# EAGLE design HW-DC26-Badge-20180426-1.1 (EAGLE 8.4.1)
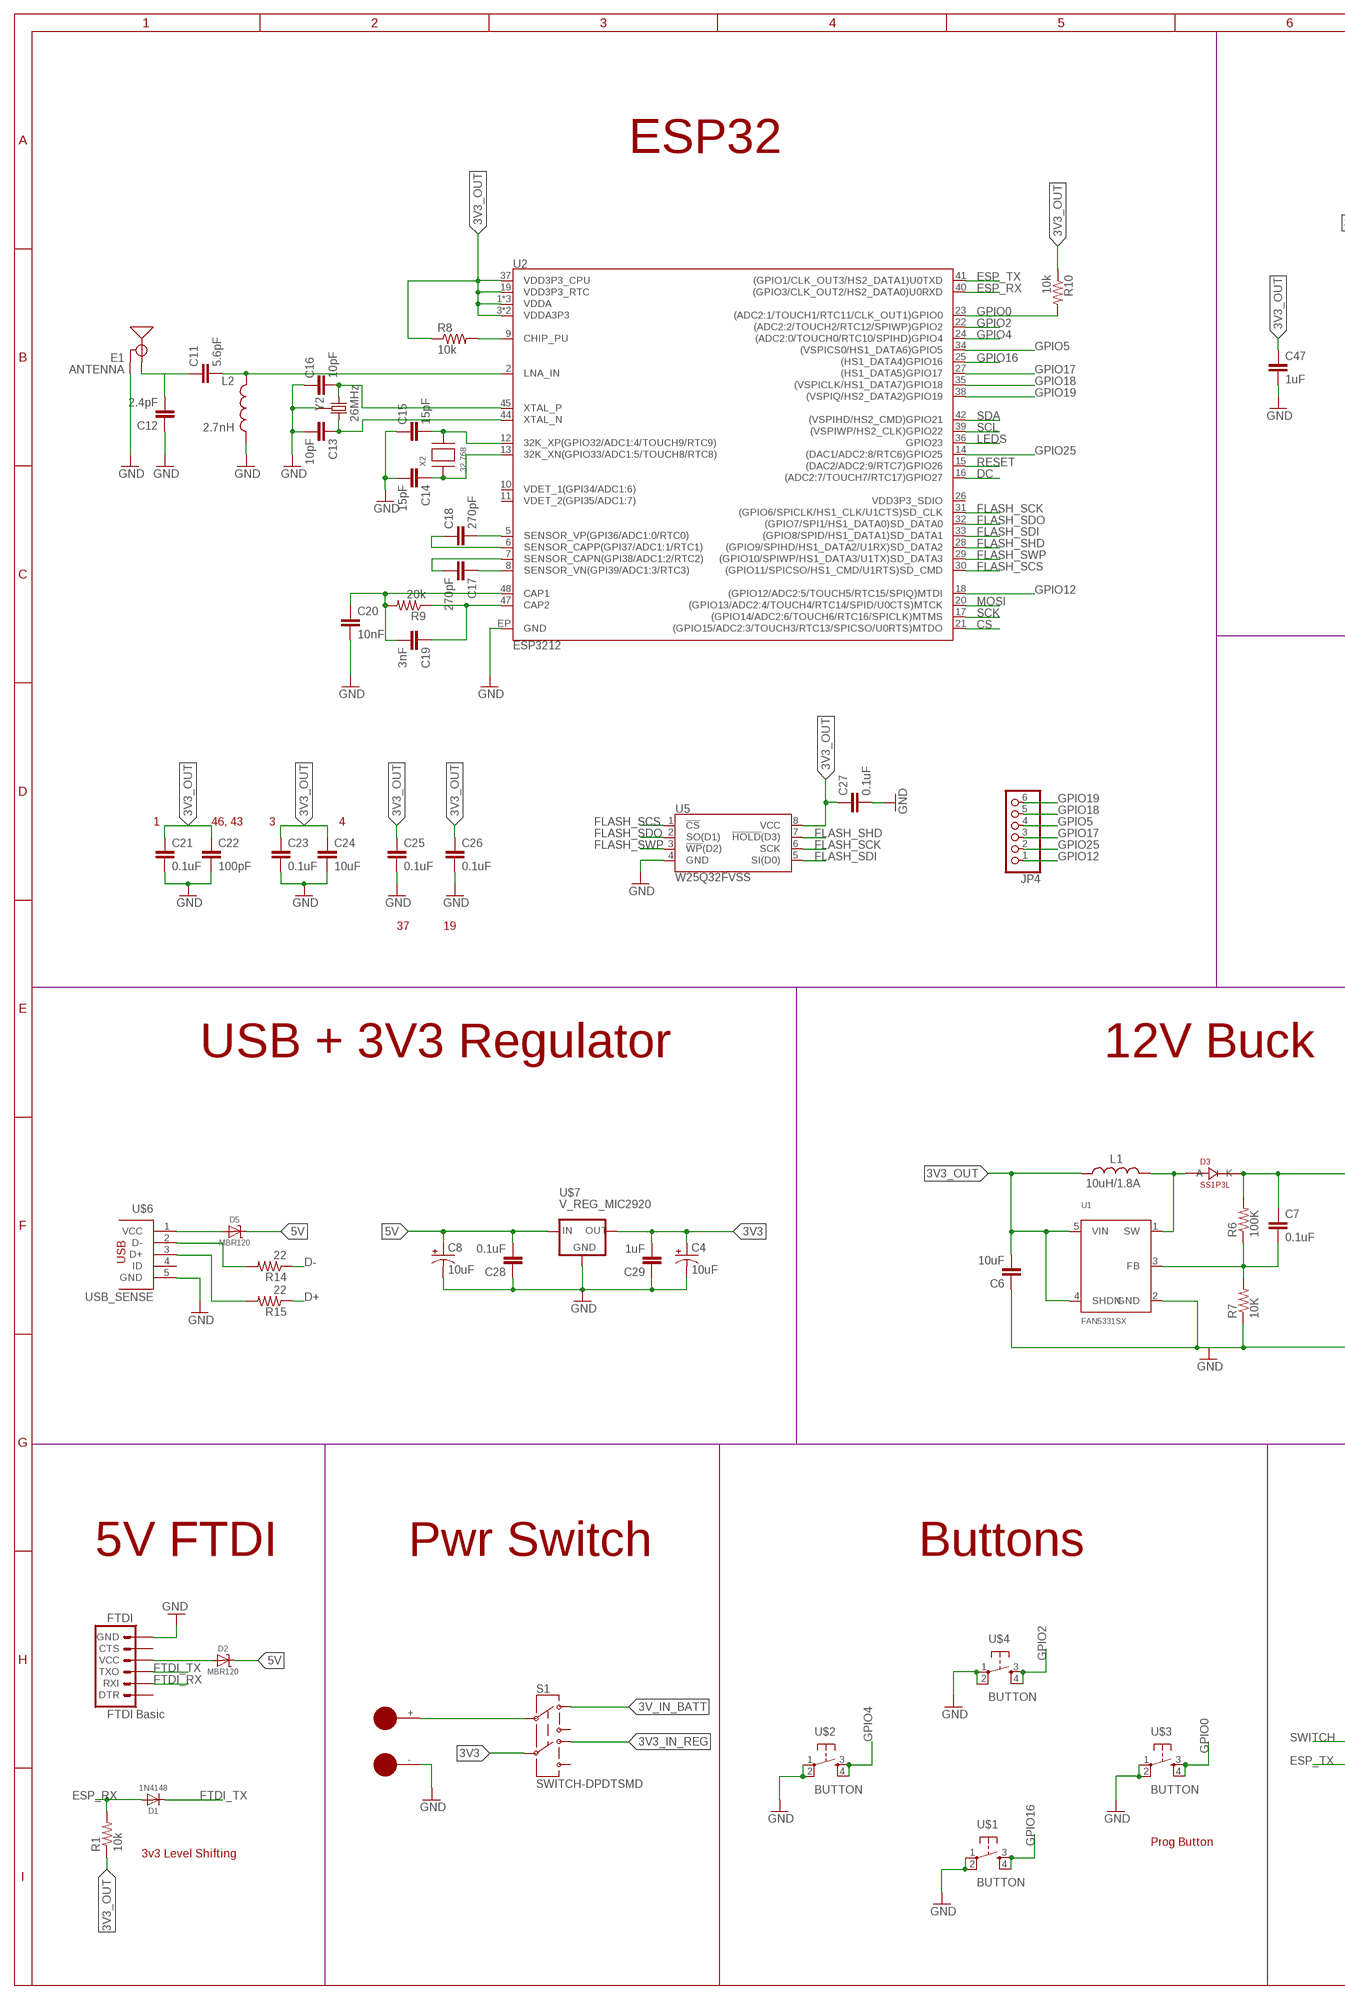
[diagram p0: schematic, sheet 1, part 1 of 2]
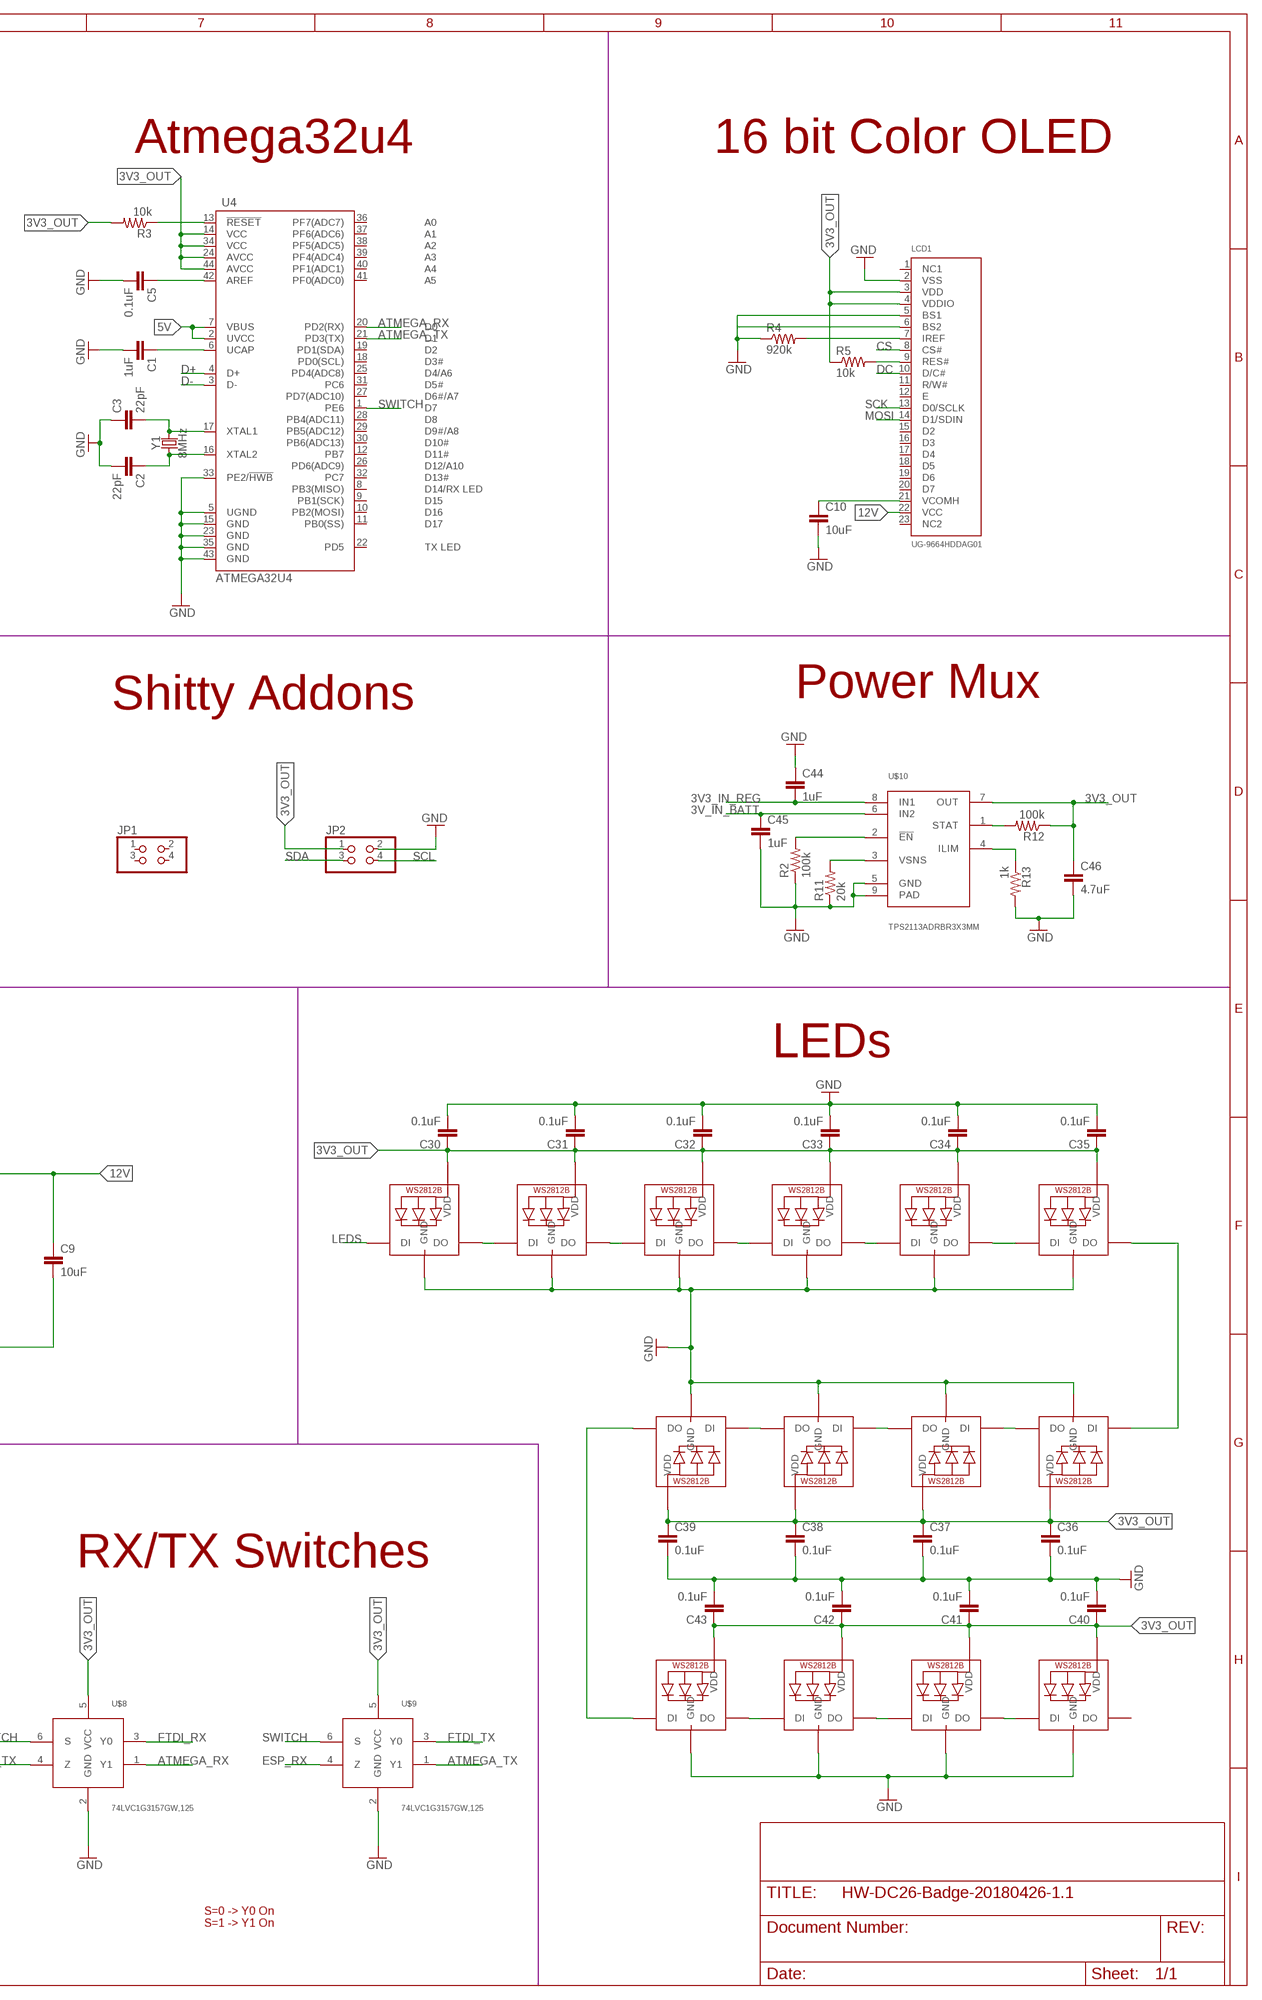
[diagram p1: schematic, sheet 1, part 2 of 2]

## Parts
C1  1uF  CAP-0603-EMPTY-VALUES  [CAP0603]
C2  22pF  CAP-0603-EMPTY-VALUES  [CAP0603]
C3  22pF  CAP-0603-EMPTY-VALUES  [CAP0603]
C4  10uF  CAP_POL1206  [EIA3216]
C5  0.1uF  CAP-0603-EMPTY-VALUES  [CAP0603]
C6  10uF  CAP-0603-10UF-10V-10%  [CAP0603]
C7  0.1uF  CAP-0603-0.1UF-25V-10%  [CAP0603]
C8  10uF  CAP_POL1206  [EIA3216]
C9  10uF  CAP-0603-10UF-25V-20%  [CAP0603]
C10  10uF  CAP-0603-EMPTY-VALUES  [CAP0603]
C11  5.6pF  CAP-0603-EMPTY-VALUES  [CAP0603]
C12  2.4pF  CAP-0603-EMPTY-VALUES  [CAP0603]
C13  10pF  CAP-0603-EMPTY-VALUES  [CAP0603]
C14  15pF  CAP-0603-EMPTY-VALUES  [CAP0603]
C15  15pF  CAP-0603-EMPTY-VALUES  [CAP0603]
C16  10pF  CAP-0603-EMPTY-VALUES  [CAP0603]
C17  270pF  CAP-0603-EMPTY-VALUES  [CAP0603]
C18  270pF  CAP-0603-EMPTY-VALUES  [CAP0603]
C19  3nF  CAP-0603-EMPTY-VALUES  [CAP0603]
C20  10nF  CAP-0603-EMPTY-VALUES  [CAP0603]
C21  0.1uF  CAP-0603-EMPTY-VALUES  [CAP0603]
C22  100pF  CAP-0603-EMPTY-VALUES  [CAP0603]
C23  0.1uF  CAP-0603-EMPTY-VALUES  [CAP0603]
C24  10uF  CAP-0603-EMPTY-VALUES  [CAP0603]
C25  0.1uF  CAP-0603-EMPTY-VALUES  [CAP0603]
C26  0.1uF  CAP-0603-EMPTY-VALUES  [CAP0603]
C27  0.1uF  CAP-0603-EMPTY-VALUES  [CAP0603]
C28  0.1uF  CAP-0603-EMPTY-VALUES  [CAP0603]
C29  1uF  CAP-0603-EMPTY-VALUES  [CAP0603]
C30  0.1uF  CAP-0603-EMPTY-VALUES  [CAP0603]
C31  0.1uF  CAP-0603-EMPTY-VALUES  [CAP0603]
C32  0.1uF  CAP-0603-EMPTY-VALUES  [CAP0603]
C33  0.1uF  CAP-0603-EMPTY-VALUES  [CAP0603]
C34  0.1uF  CAP-0603-EMPTY-VALUES  [CAP0603]
C35  0.1uF  CAP-0603-EMPTY-VALUES  [CAP0603]
C36  0.1uF  CAP-0603-EMPTY-VALUES  [CAP0603]
C37  0.1uF  CAP-0603-EMPTY-VALUES  [CAP0603]
C38  0.1uF  CAP-0603-EMPTY-VALUES  [CAP0603]
C39  0.1uF  CAP-0603-EMPTY-VALUES  [CAP0603]
C40  0.1uF  CAP-0603-EMPTY-VALUES  [CAP0603]
C41  0.1uF  CAP-0603-EMPTY-VALUES  [CAP0603]
C42  0.1uF  CAP-0603-EMPTY-VALUES  [CAP0603]
C43  0.1uF  CAP-0603-EMPTY-VALUES  [CAP0603]
C44  1uF  CAP-0603-EMPTY-VALUES  [CAP0603]
C45  1uF  CAP-0603-EMPTY-VALUES  [CAP0603]
C46  4.7uF  CAP-0603-EMPTY-VALUES  [CAP0603]
C47  1uF  CAP-0603-EMPTY-VALUES  [CAP0603]
D1  1N4148  DIODESOD-323  [SOD-323]
D2  MBR120  DIODE-SCHOTTKYSOD-123  [SOD-123]
D3  SS1P3L  [DO220AAL]
D5  MBR120  DIODE-SCHOTTKYSOD-123  [SOD-123]
E1  ANTENNA  ANTENNATRACE-TUNED  [TRACE_ANTENNA_2.4GHZ_25.7MM_TUNED]
FTDI  FTDI Basic  ARDUINO_SERIAL_PROGRAMPTH  [1X06]
JP1  PINHD-2X2  [2X02]
JP2  PINHD-2X2  [2X02]
JP4  PINHD-1X6  [1X06]
L1  10uH/1.8A  INDUCTORSRU5028  [SRU5028]
L2  2.7nH  INDUCTOR0603  [0603]
LCD1  UG-9664HDDAG01  DISP_OLED_UG-9664HDDAG01WRAPAROUND  [UG-9664HDDAG01_WRAPAROUND]
LED1  WS2812B3535  [LED3535]
LED2  WS2812B3535  [LED3535]
LED3  WS2812B3535  [LED3535]
LED4  WS2812B3535  [LED3535]
LED5  WS2812B3535  [LED3535]
LED6  WS2812B3535  [LED3535]
LED7  WS2812B3535  [LED3535]
LED8  WS2812B3535  [LED3535]
LED9  WS2812B3535  [LED3535]
LED10  WS2812B3535  [LED3535]
LED11  WS2812B3535  [LED3535]
LED12  WS2812B3535  [LED3535]
LED13  WS2812B3535  [LED3535]
LED14  WS2812B3535  [LED3535]
R1  10k  RES-0603_EMPTY-FIELDS  [RES-0603]
R2  100k  RES-0603_EMPTY-FIELDS  [RES-0603]
R3  10k  RES-0603_EMPTY-FIELDS  [RES-0603]
R4  920k  RES-0603_EMPTY-FIELDS  [RES-0603]
R5  10k  RES-0603_EMPTY-FIELDS  [RES-0603]
R6  100K  RES-0603-100K-5%  [RES-0603]
R7  10K  RES-0603-10K-5%  [RES-0603]
R8  10k  RES-0603_EMPTY-FIELDS  [RES-0603]
R9  20k  RES-0603_EMPTY-FIELDS  [RES-0603]
R10  10k  RES-0603_EMPTY-FIELDS  [RES-0603]
R11  20k  RES-0603_EMPTY-FIELDS  [RES-0603]
R12  100k  RES-0603_EMPTY-FIELDS  [RES-0603]
R13  1k  RES-0603_EMPTY-FIELDS  [RES-0603]
R14  22  RES-0603_EMPTY-FIELDS  [RES-0603]
R15  22  RES-0603_EMPTY-FIELDS  [RES-0603]
S1  SWITCH-DPDTSMD  [AYZ0202]
U1  FAN5331SX  FAN5331  [SOT23-5]
U2  ESP3212  [QFN48-0.4MM]
U4  ATMEGA32U4  ATMEGA32U4OUTFAKES  [QFN-44-NOPAD_1:1-OUTFAKES]
U5  W25Q32FVSS  [SOIC-8]
U$1  BUTTON  [BUTTON]
U$2  BUTTON  [BUTTON]
U$3  BUTTON  [BUTTON]
U$4  BUTTON  [BUTTON]
U$5  BAT_HOLD  [AA]
U$6  USB_SENSE  [USB-MICRO-TH-SUPPORT]
U$7  V_REG_MIC2920  [SOT223]
U$8  74LVC1G3157GW,125  [SOT-363]
U$9  74LVC1G3157GW,125  [SOT-363]
U$10  TPS2113ADRBR3X3MM  [8-VDFN]
X2  32.768  XTAL-3.2X1.5  [XTAL3215]
Y1  8MHz  CRYSTAL-8MHZSMD-5X3.2  [CRYSTAL-SMD-5X3.2-4PAD]
Y2  26MHz  CRYSTAL-GROUNDED3.2X2.5  [CRYSTAL-SMD-3.2X2.5]

## Nets
3V3: C4.A(+) C29.2 S1.5 U$7.3(OUT)
3V3_IN_REG: C44.2 S1.4 U$10.8(IN1)
3V3_OUT: C6.2 C21.1 C22.1 C23.1 C24.1 C25.1 C26.1 C27.1 C30.1 C31.1 C32.1 C33.1 C34.1 C35.1 C36.1 C37.1 C38.1 C39.1 C40.1 C41.1 C42.1 C43.1 C46.1 C47.1 JP2.1 L1.1 LCD1.3(VDD) LCD1.4(VDDIO) LED1.2(VDD) LED2.2(VDD) LED3.2(VDD) LED4.2(VDD) LED5.2(VDD) LED6.2(VDD) LED7.2(VDD) LED8.2(VDD) LED9.2(VDD) LED10.2(VDD) LED11.2(VDD) LED12.2(VDD) LED13.2(VDD) LED14.2(VDD) R1.1 R3.2 R5.1 R8.1 R10.1 R12.1 U1.4(SHDN) U1.5(VIN) U2.1(VDDA) U2.3(VDDA3P3) U2.4(VDDA3P3) U2.19(VDD3P3_RTC) U2.37(VDD3P3_CPU) U2.43(VDDA) U2.46(VDDA) U4.14(VCC) U4.24(AVCC) U4.34(VCC) U4.44(AVCC) U5.8(VCC) U$8.5(VCC) U$9.5(VCC) U$10.7(OUT)
3V_IN_BATT: C45.1 S1.1 U$10.6(IN2)
5V: C8.A(+) C28.2 D2.C D5.C U4.2(UVCC) U4.7(VBUS) U$7.1(IN)
12V: C7.1 C9.1 D3.P$1(K) LCD1.22(VCC) R6.2
ATMEGA_RX: U4.20(PD2(RX)) U$8.1(Y1)
ATMEGA_TX: U4.21(PD3(TX)) U$9.1(Y1)
CS: LCD1.8(CS#) U2.21((GPIO15/ADC2:3/TOUCH3/RTC13/SPICSO/U0RTS)MTDO)
D+: R15.1 U4.4(D+)
D-: R14.1 U4.3(D-)
DC: LCD1.10(D/C#) U2.16((ADC2:7/TOUCH7/RTC17)GPIO27)
ESP_RX: D1.A R1.2 U2.40((GPIO3/CLK_OUT2/HS2_DATA0)U0RXD) U$9.4(Z)
ESP_TX: U2.41((GPIO1/CLK_OUT3/HS2_DATA1)U0TXD) U$8.4(Z)
FLASH_SCK: U2.31((GPIO6/SPICLK/HS1_CLK/U1CTS)SD_CLK) U5.6(SCK)
FLASH_SCS: U2.30((GPIO11/SPICSO/HS1_CMD/U1RTS)SD_CMD) U5.1(!CS!)
FLASH_SDI: U2.33((GPIO8/SPID/HS1_DATA1)SD_DATA1) U5.5(SI(D0))
FLASH_SDO: U2.32((GPIO7/SPI1/HS1_DATA0)SD_DATA0) U5.2(SO(D1))
FLASH_SHD: U2.28((GPIO9/SPIHD/HS1_DATA2/U1RX)SD_DATA2) U5.7(!HOLD!(D3))
FLASH_SWP: U2.29((GPIO10/SPIWP/HS1_DATA3/U1TX)SD_DATA3) U5.3(!WP!(D2))
FTDI_RX: FTDI.2(RXI) U$8.3(Y0)
FTDI_TX: D1.C FTDI.3(TXO) U$9.3(Y0)
GND: C1.2 C2.2 C3.1 C4.C(-) C5.2 C6.1 C8.C(-) C9.2 C10.2 C12.1 C13.2 C14.2 C15.1 C16.1 C20.2 C21.2 C22.2 C23.2 C24.2 C25.2 C26.2 C27.2 C28.1 C29.1 C30.2 C31.2 C32.2 C33.2 C34.2 C35.2 C36.2 C37.2 C38.2 C39.2 C40.2 C41.2 C42.2 C43.2 C44.1 C45.2 C46.2 C47.2 E1.GND E1.GND2(GND) FTDI.6(GND) JP2.2 L2.2 LCD1.2(VSS) LCD1.5(BS1) LED1.4(GND) LED2.4(GND) LED3.4(GND) LED4.4(GND) LED5.4(GND) LED6.4(GND) LED7.4(GND) LED8.4(GND) LED9.4(GND) LED10.4(GND) LED11.4(GND) LED12.4(GND) LED13.4(GND) LED14.4(GND) R2.1 R4.1 R7.1 R11.1 R13.2 U1.2(GND) U2.EP(GND) U4.5(UGND) U4.15(GND) U4.23(GND) U4.33(PE2/!HWB) U4.35(GND) U4.43(GND) U5.4(GND) U$1.1 U$1.2 U$2.1 U$2.2 U$3.1 U$3.2 U$4.1 U$4.2 U$5.- U$6.5(GND) U$7.2(GND) U$7.4(GND) U$8.2(GND) U$9.2(GND) U$10.5(GND) U$10.9(PAD) Y2.2(GND) Y2.4(GND)
GPIO0: R10.2 U2.23((ADC2:1/TOUCH1/RTC11/CLK_OUT1)GPIO0) U$3.3 U$3.4
GPIO2: U2.22((ADC2:2/TOUCH2/RTC12/SPIWP)GPIO2) U$4.3 U$4.4
GPIO4: U2.24((ADC2:0/TOUCH0/RTC10/SPIHD)GPIO4) U$2.3 U$2.4
GPIO5: JP4.4 U2.34((VSPICS0/HS1_DATA6)GPIO5)
GPIO12: JP4.1 U2.18((GPIO12/ADC2:5/TOUCH5/RTC15/SPIQ)MTDI)
GPIO16: U2.25((HS1_DATA4)GPIO16) U$1.3 U$1.4
GPIO17: JP4.3 U2.27((HS1_DATA5)GPIO17)
GPIO18: JP4.5 U2.35((VSPICLK/HS1_DATA7)GPIO18)
GPIO19: JP4.6 U2.38((VSPIQ/HS2_DATA2)GPIO19)
GPIO25: JP4.2 U2.14((DAC1/ADC2:8/RTC6)GPIO25)
LEDS: LED5.1(DI) U2.36(GPIO23)
MOSI: LCD1.14(D1/SDIN) U2.20((GPIO13/ADC2:4/TOUCH4/RTC14/SPID/U0CTS)MTCK)
N$1: C3.2 U4.17(XTAL1) Y1.3
N$2: R3.1 U4.13(!RESET)
N$3: C1.1 U4.6(UCAP)
N$4: C5.1 U4.42(AREF)
N$5: R14.2 U$6.2(D-)
N$6: C10.1 LCD1.21(VCOMH)
N$7: D3.P$2(A) L1.2 U1.1(SW)
N$8: C2.1 U4.16(XTAL2) Y1.1
N$9: LCD1.6(BS2)
N$10: LED1.1(DI) LED14.3(DO)
N$11: C7.2 R6.1 R7.2 U1.3(FB)
N$13: LCD1.7(IREF) R4.2
N$14: S1.2 U$5.+
N$15: R8.2 U2.9(CHIP_PU)
N$16: C16.2 U2.45(XTAL_P) Y2.1
N$17: C11.1 C12.2 E1.ANT(SIGNAL)
N$19: LED1.3(DO) LED2.1(DI)
N$20: D2.A FTDI.4(VCC)
N$21: LED5.3(DO) LED6.1(DI)
N$22: C19.2 C20.1 R9.2 U2.48(CAP1)
N$23: C11.2 L2.1 U2.2(LNA_IN)
N$24: C13.1 U2.44(XTAL_N) Y2.3
N$25: C19.1 R9.1 U2.47(CAP2)
N$26: C15.2 U2.12(32K_XP(GPIO32/ADC1:4/TOUCH9/RTC9)) X2.P$2
N$27: C14.1 U2.13(32K_XN(GPIO33/ADC1:5/TOUCH8/RTC8)) X2.P$1
N$28: C18.2 U2.5(SENSOR_VP(GPI36/ADC1:0/RTC0))
N$29: C18.1 U2.6(SENSOR_CAPP(GPI37/ADC1:1/RTC1))
N$30: C17.2 U2.7(SENSOR_CAPN(GPI38/ADC1:2/RTC2))
N$31: C17.1 U2.8(SENSOR_VN(GPI39/ADC1:3/RTC3))
N$32: D5.A U$6.1(VCC)
N$33: LED6.3(DO) LED7.1(DI)
N$34: LED7.3(DO) LED8.1(DI)
N$35: LED8.3(DO) LED9.1(DI)
N$36: LED9.3(DO) LED11.1(DI)
N$37: LED11.3(DO) LED13.1(DI)
N$38: LED10.1(DI) LED13.3(DO)
N$39: LED10.3(DO) LED12.1(DI)
N$40: LED12.3(DO) LED14.1(DI)
N$41: LED2.3(DO) LED3.1(DI)
N$42: LED3.3(DO) LED4.1(DI)
N$45: R15.2 U$6.3(D+)
N$53: R2.2 U$10.2(!EN)
N$54: R11.2 U$10.3(VSNS)
N$58: R12.2 U$10.1(STAT)
N$60: R13.1 U$10.4(ILIM)
RESET: LCD1.9(RES#) R5.2 U2.15((DAC2/ADC2:9/RTC7)GPIO26)
SCK: LCD1.13(D0/SCLK) U2.17((GPIO14/ADC2:6/TOUCH6/RTC16/SPICLK)MTMS)
SCL: JP2.4 U2.39((VSPIWP/HS2_CLK)GPIO22)
SDA: JP2.3 U2.42((VSPIHD/HS2_CMD)GPIO21)
SWITCH: U4.1(PE6) U$8.6(S) U$9.6(S)
Unconnected: FTDI.1(DTR) FTDI.5(CTS) JP1.1 JP1.2 JP1.3 JP1.4 LCD1.1(NC1) LCD1.11(R/W#) LCD1.12(E) LCD1.15(D2) LCD1.16(D3) LCD1.17(D4) LCD1.18(D5) LCD1.19(D6) LCD1.20(D7) LCD1.23(NC2) LED4.3(DO) S1.3 S1.6 U2.10(VDET_1(GPI34/ADC1:6)) U2.11(VDET_2(GPI35/ADC1:7)) U2.26(VDD3P3_SDIO) U4.8(PB3(MISO)) U4.9(PB1(SCK)) U4.10(PB2(MOSI)) U4.11(PB0(SS)) U4.12(PB7) U4.18(PD0(SCL)) U4.19(PD1(SDA)) U4.22(PD5) U4.25(PD4(ADC8)) U4.26(PD6(ADC9)) U4.27(PD7(ADC10)) U4.28(PB4(ADC11)) U4.29(PB5(ADC12)) U4.30(PB6(ADC13)) U4.31(PC6) U4.32(PC7) U4.36(PF7(ADC7)) U4.37(PF6(ADC6)) U4.38(PF5(ADC5)) U4.39(PF4(ADC4)) U4.40(PF1(ADC1)) U4.41(PF0(ADC0)) U$6.4(ID)

## Notes on the sheet
- ESP32 | Atmega32u4 | 16 bit Color OLED
- Shitty Addons | Power Mux
- 1 | 46, 43 | 3 | 4
- 37 | 19
- USB + 3V3 Regulator | 12V Buck | LEDs
- 5V FTDI | Pwr Switch | Buttons | RX/TX Switches
- Prog Button
- 3v3 Level Shifting
- S=0 -> Y0 On
  S=1 -> Y1 On

## Library data of the parts
C1-C3 C5 C10-C47 = Jaycon OPL Capacitors:CAP-0603: Jaycon Systems OPL Capacitors 0603 Package. The name for the part has the Value - Voltage - Tolerance making part selection simple.; SIZE: 0603
C4 C8 = SparkFun-Passives:CAP_POL: Capacitor Polarized These are standard SMD and PTH capacitors. Normally 10uF, 47uF, and 100uF in electrolytic and tantalum varieties. Always verify the external diameter of the through hole cap, it varies with capacity, voltage, and manufacturer. The EIA devices should be standard.
C6 = Jaycon OPL Capacitors:CAP-0603: Jaycon Systems OPL Capacitors 0603 Package. The name for the part has the Value - Voltage - Tolerance making part selection simple.; JAYCON: CP-0070; MFG#1: GRM188R61A106KE69D; SIZE: 0603; TEMPERATURE-COEFFICIENT: X5R; TOLERANCE: 10%; VOLTAGE: 10V
C7 = Jaycon OPL Capacitors:CAP-0603: Jaycon Systems OPL Capacitors 0603 Package. The name for the part has the Value - Voltage - Tolerance making part selection simple.; JAYCON: CP-0066; MFG#1: C1608X7R1E104KT; SIZE: 0603; TEMPERATURE-COEFFICIENT: X7R; TOLERANCE: 10%; VOLTAGE: 25V
C9 = Jaycon OPL Capacitors:CAP-0603: Jaycon Systems OPL Capacitors 0603 Package. The name for the part has the Value - Voltage - Tolerance making part selection simple.; JAYCON: CP-0044; MFG#1: CL10A106MA8NRNC; SIZE: 0603; TEMPERATURE-COEFFICIENT: X5R; TOLERANCE: 20%; VOLTAGE: 25V
D1 = microbuilder:DIODE: Diode SMA Model Volts Amps Type Vf Ir Digikey # Notes SSA34-E3 40V 3A Schottky 480mV @ 3A 200uA @ 40V SSA34-E3/61TGITR-ND CDBA120-G 20V 1A Schottky 500mV @ 1A 500uA @ 20V 641-1014-6-ND REEL MBRA210 10V 2A Schottky 350mV @ 2A 700uA @ 10V MBRA210LT3 SOD-123 Model Volts Amps Type Vf Ir Order # Notes BAT54T1G 30V 200mA Schottky 800mV @ 200mA 2uA @ 25V BAT54T1GOSTR-ND B0530W 30V 500mA Schottky 430mV @ 500mA 130uA @ 30V B0530W-FDICT-ND REEL MBR120 20V 1A Schottky 340mV @ 1A MBR120VLSFT1GOSCT-ND SOD-323 Model Volts Amps Type Vf Ir Order # Notes PMEG2005EJ 20V 500mA Schottky 355mV @ 500mA 568-4110-1-ND ZLLS410 10V 570mA Schottky 380mV @ 570mA ZLLS410CT-ND 1N4148WS 75V 150mA Silicon/Simple 1V 1N4148WSFSCT-ND REEL SOD-523 Model Volts Amps Type Vf Ir Order # Notes BAT54XV2 30V 200mA Schottky 0.8V @ 100mA BAT54XV2CT-ND TB751S 30V 30mA Schottky RB751S-40TE61CT-ND SOT23-R/W (R = Solder Paste/Reflow Ovens, W = Hand-Soldering) Model Volts Amps Type Vf Ir Order # Notes BAT54FILM 40V 300mA Schottky 497-7162-1-ND POWERDI-5 Model Volts Amps Type Vf Ir Order # Notes PDS560 60V 5A Schottky 670mV @ 5A 150uA @ 60V PDS560DICT-ND
D2 D5 = microbuilder:DIODE-SCHOTTKY
D3 = SmartPrj:SS1P3L; OC_NEWARK: unknown
E1 = esp32-thing-temp:ANTENNA: Chip antenna Chip antenna with ground or secondary connection. Common with larger metal RF connectors.
FTDI = SparkFun:ARDUINO_SERIAL_PROGRAM
JP1 JP2 = pinhead:PINHD-2X2: PIN HEADER
JP4 = pinhead:PINHD-1X6: PIN HEADER
L1 = SparkFun:INDUCTOR: Inductors
L2 = SparkFun-Passives:INDUCTOR: Inductors; PROD_ID: NDUC-08762
LCD1 = microbuilder:DISP_OLED_UG-9664HDDAG01: OLED 96x64 Pixel, 0.95" 65K Color
LED1-LED14 = adafruit:WS2812B
R1-R5 R8-R15 = Jaycon OPL Resistors:RES-0603: SMD 0603 Resistor Library; SIZE: 0603; WATTAGE: 0.1W
R6 = Jaycon OPL Resistors:RES-0603: SMD 0603 Resistor Library; JAYCON: RS-0013; SIZE: 0603; TOLERANCE: 5%; VISHAY-MFG: RCG0603100KJNEA; WATTAGE: 0.1W
R7 = Jaycon OPL Resistors:RES-0603: SMD 0603 Resistor Library; JAYCON: RS-0027; ROHM-MFG: MCR03EZPJ103; SAMSUNG-MFG: RC1608J103CS; SIZE: 0603; TOLERANCE: 5%; VISHAY-MFG: CRCW060310K0JNEA; WATTAGE: 0.1W; YAGEO-MFG: RC0603JR-0710KP
S1 = SparkFun:SWITCH-DPDT: DPDT Version of the COM-00597
U1 = microbuilder:FAN5331: FAN5331 - LED/OLED 20V Boost Converter Digikey: FAN5331SXCT-ND
U2 = esp32-thing-temp:ESP3212; PROD_ID: IC-13338
U4 = Testing:ATMEGA32U4: Atmel 44-pin 8-bit Microcontroller with 32KBytes of ISP Flash and USB Controller
U5 = SparkFun-DigitalIC:W25Q32FV: Winbond W25Q32FV 32Mbit (4MB) Flash The W25Q32FV support the standard Serial Peripheral Interface (SPI), Dual/Quad I/O SPI as well as 2-clocks instruction cycle Quad Peripheral Interface (QPI). Datasheet <http://www.winbond.com/resource-files/w25q32fv%20revh%20091613.pdf>; PROD_ID: IC-13229
U$1-U$4 = WiFiButton:BUTTON
U$5 = Badge:BAT_HOLD
U$6 = JAYCONSYSTEMS:USB_SENSE
U$7 = JAYCONSYSTEMS:V_REG_MIC2920: MIC2920A (http://www.micrel.com/_PDF/mic2920.pdf) - 400mA output LDO Regulator
U$8 U$9 = Jaycon:74LVC1G3157GW,125
U$10 = Jaycon:TPS2113ADRBR
X2 = adafruit2:XTAL: Low cost SMT crystals, no capacitors included http://www.ladyada.net/library/eagle
Y1 = SparkFun-Clocks:CRYSTAL-8MHZ: 8MHz Crystal Datasheet Example <http://www.futureelectronics.com/en/technologies/electromechanical/timing-devices/crystals/Pages/6008189-ABM3B-8.000MHZ-B2-T.aspx?IM=0> Frequency: 8MHz Frequency Tolerance: ±20ppm Load Capacitance: 18pF SparkFun Products: Pro Micro -3.3V/8MHz <https://www.sparkfun.com/products/12587> WAV Trigger <https://www.sparkfun.com/products/13660>; PROD_ID: XTAL-09431
Y2 = things:CRYSTAL-GROUNDED; PROD_ID: XTAL-12454

## Board
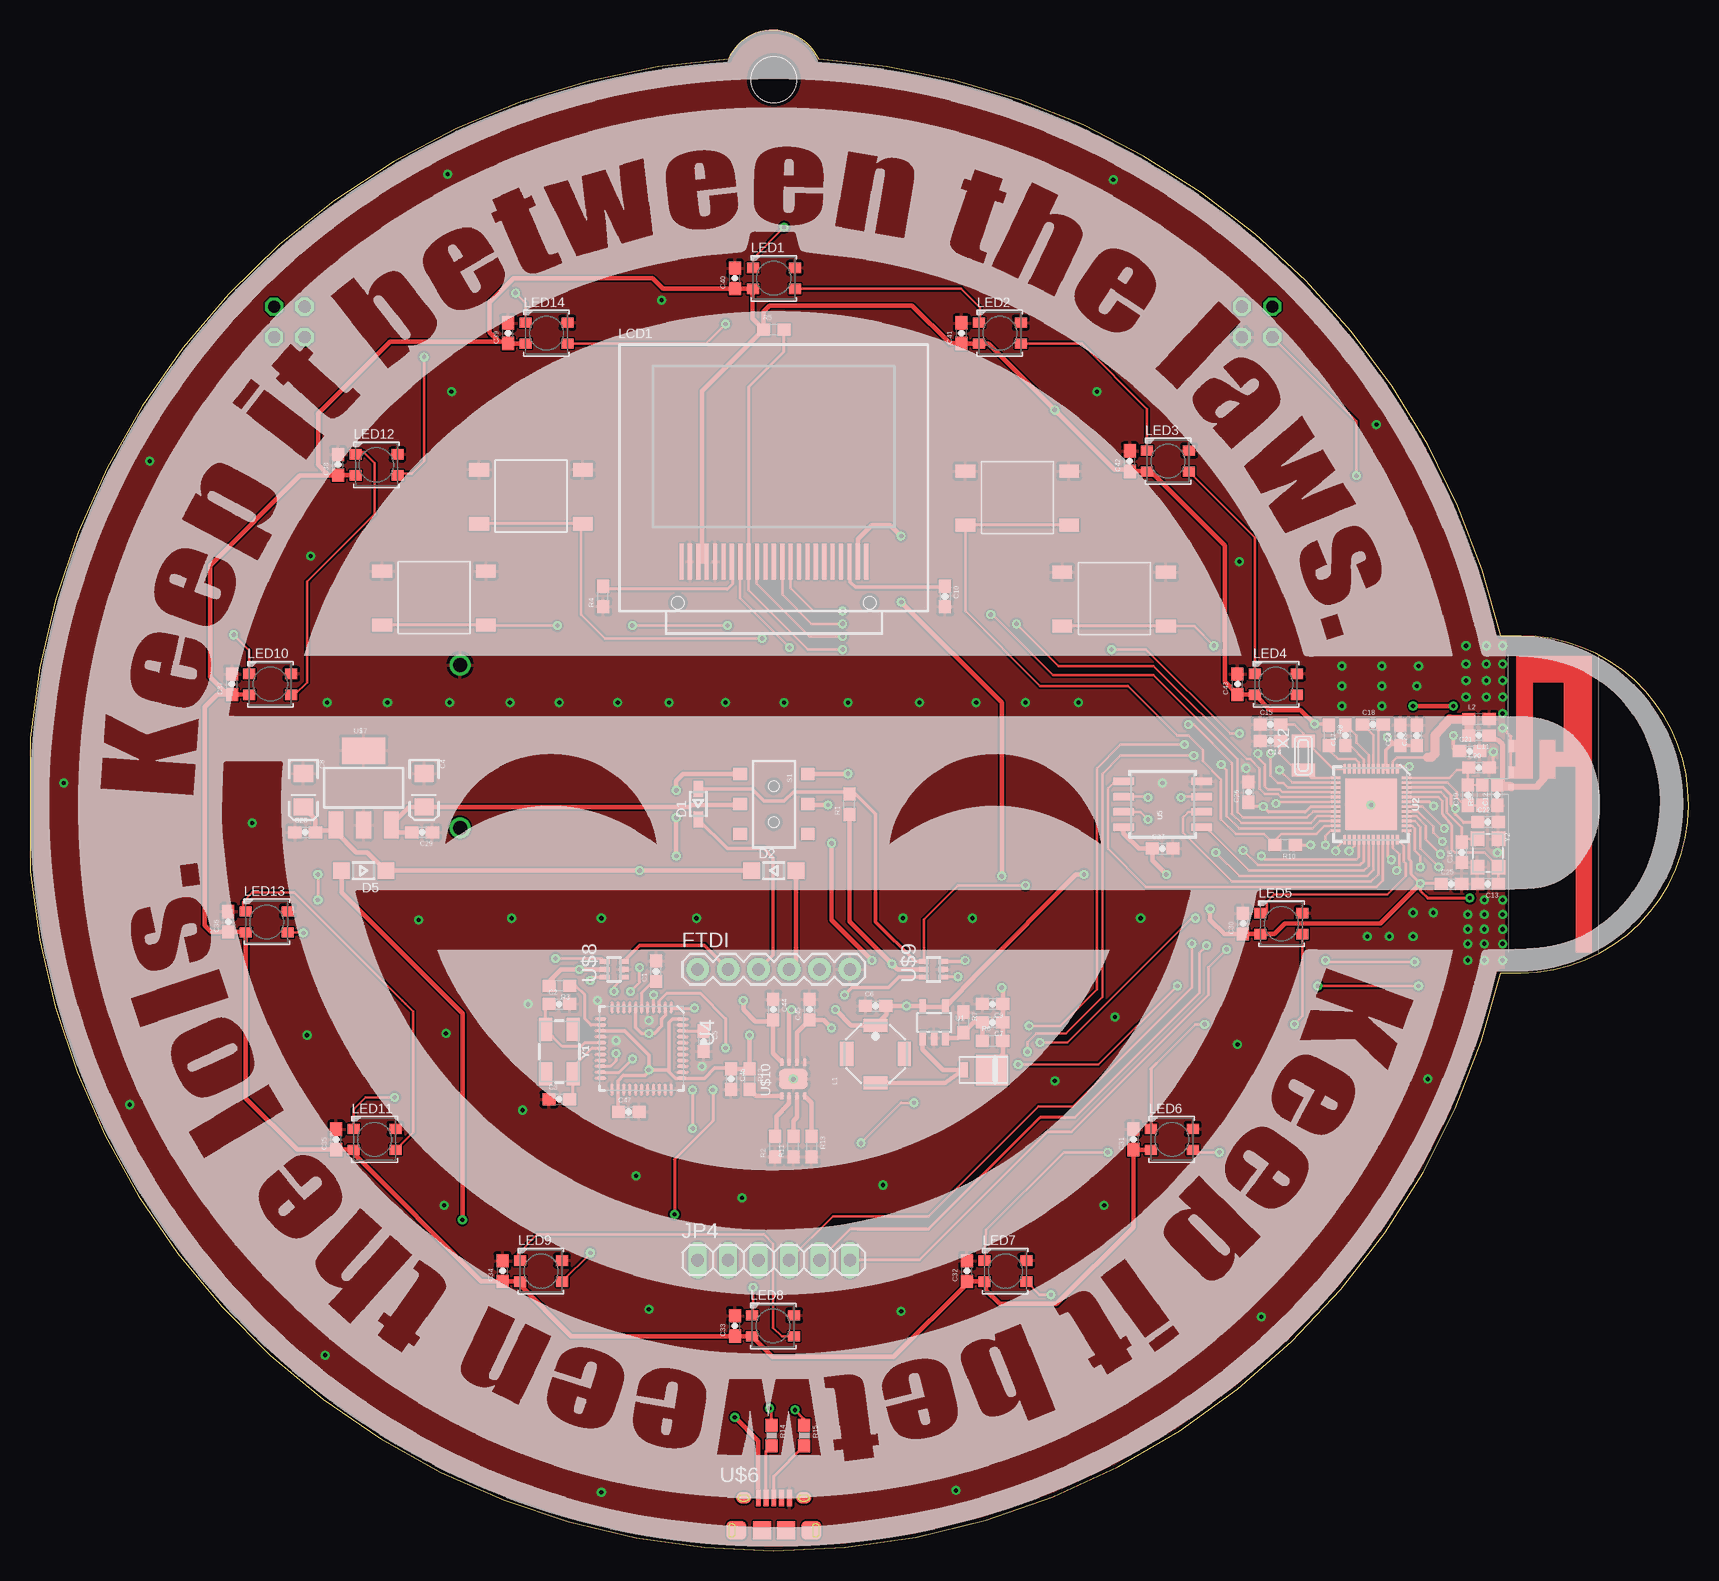
[diagram p2: board, top side]
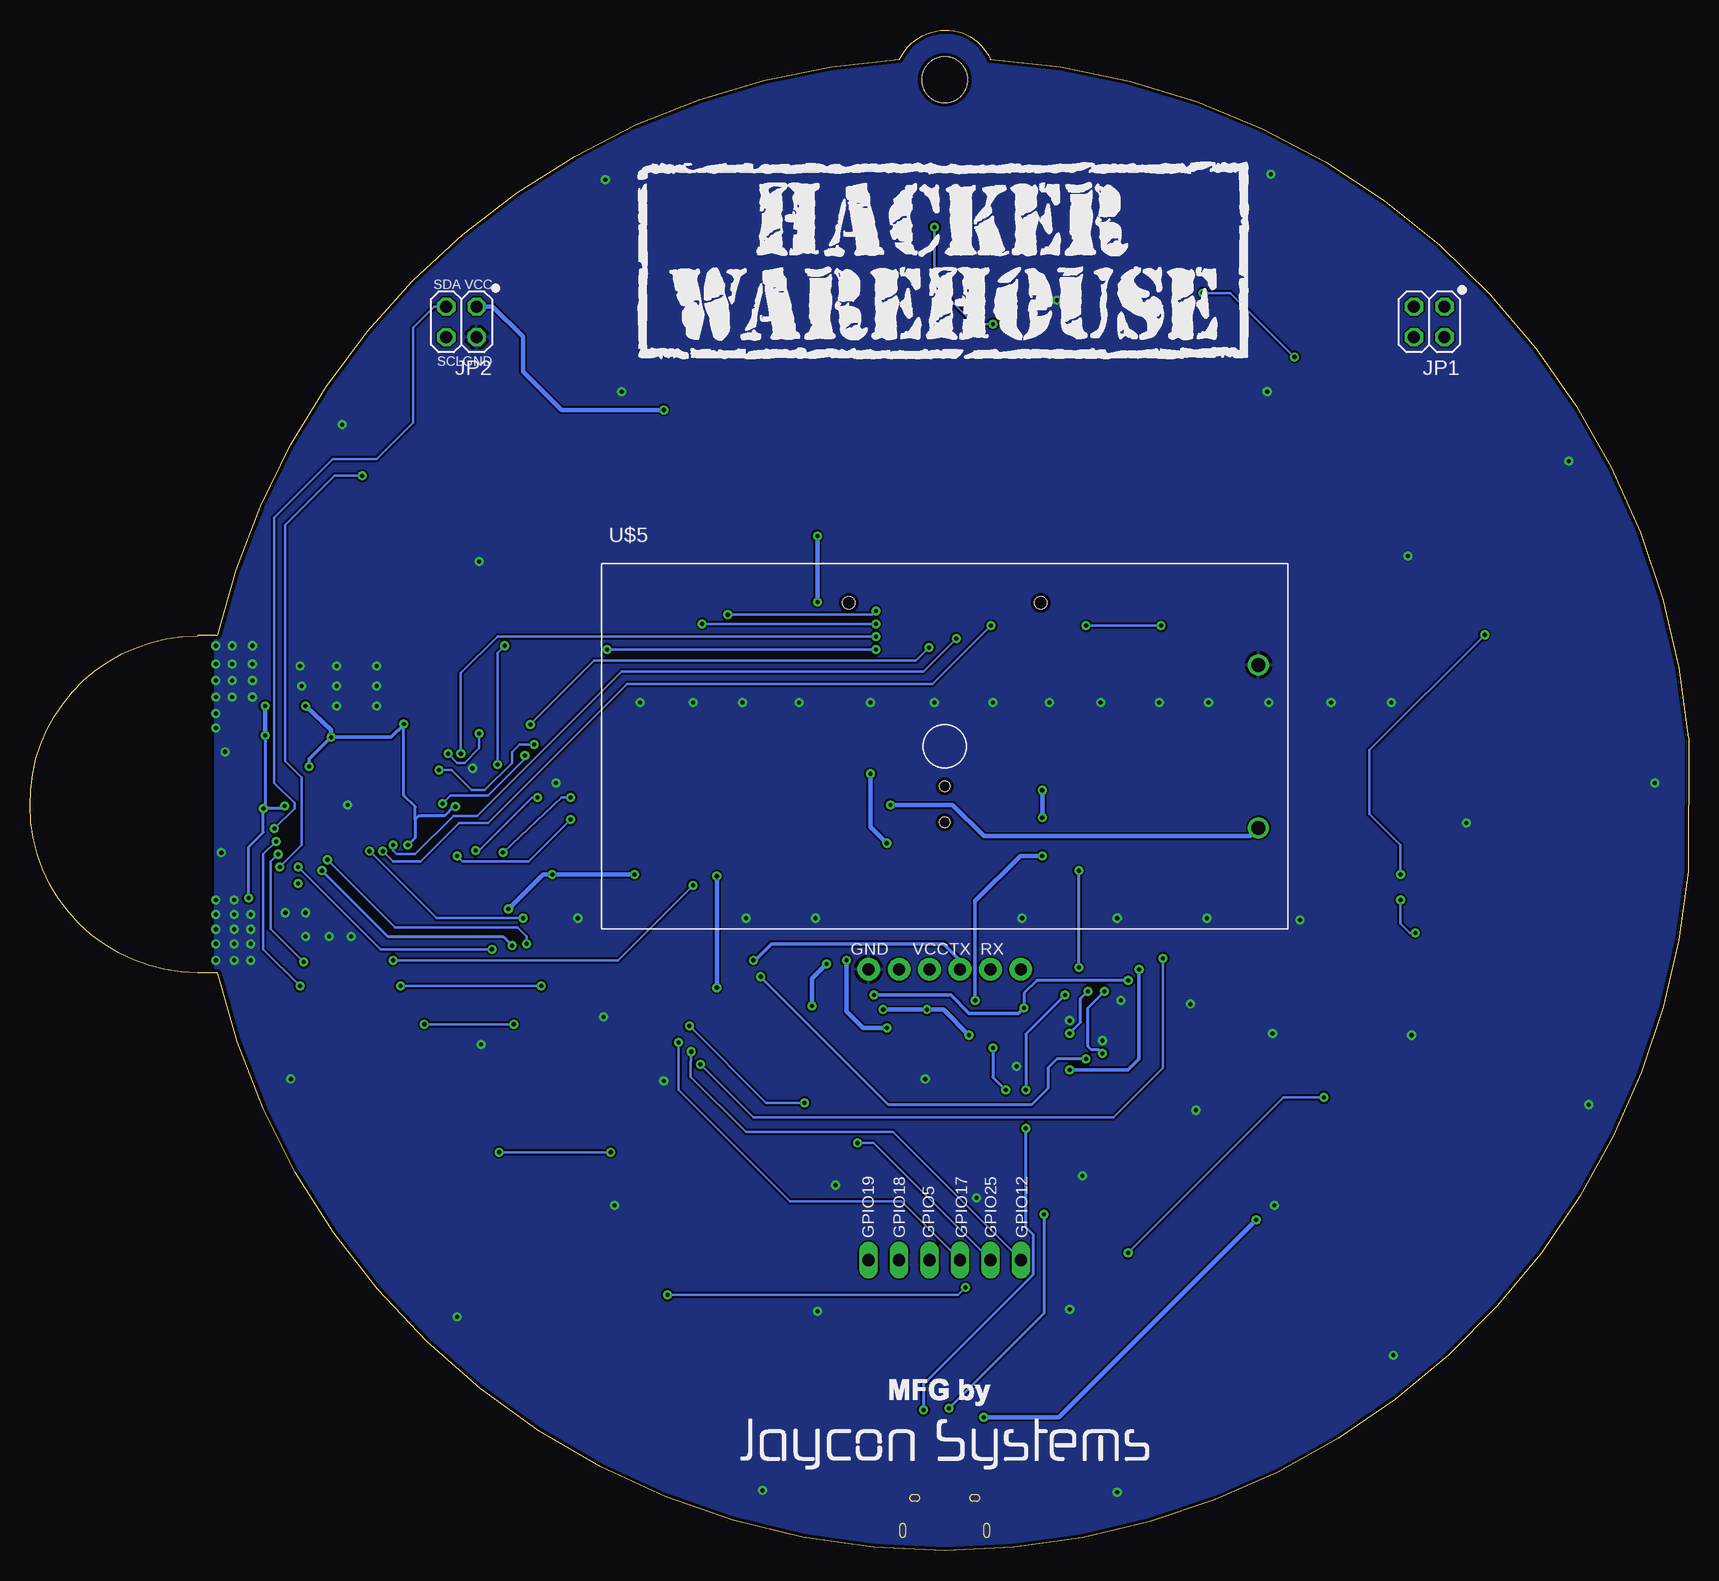
[diagram p3: board, bottom side, seen from below]

Size 138.25 x 126.77 mm. Coordinates in mm from the lower left corner, seen from the top.
Outline: 58.22,124.33 arc81 0.01,67.77
Outline: 65.76,124.33 arc-73 122.61,76.28 124.28,76.28
Outline: 124.28,76.27 arc-91 138.25,62.13 arc-90 124.28,48.18 122.61,48.18 arc-77 61.98,0
Outline: 61.98,0.01 arc-85 0.03,56.62 0,67.77
Outline: 61.95,126.77 arc67 58.21,124.34
Outline: 65.76,124.33 arc64 61.95,126.77
Copper layers (1*16): Top 0.035mm / dielectric 1.5mm / Bottom 0.035mm
Design rules "default *": minimum track width 6mil, minimum drill 0.35mm, track to track 6mil, track to pad 6mil, pad to pad 6mil, via to via 6mil, smd to smd 6mil, copper to edge 12mil, drill to drill 8mil, minimum pad ring 10mil, minimum via ring 8mil, stop-mask expansion 4mil, vias tented up to drill 14mil, thermal gap 10mil
Holes 3.81 mm at 62,122.61

### Footprints (pad centres in the part's own frame; a part is rotated, then mirrored left to right if it is on the bottom)
CAP0603 = smd 1.1 x 1: 1 -0.85,0; 2 0.85,0
EIA3216 = smd 1.4 x 1.6: A 1.4,0; C -1.4,0
SOD-323 = smd 1.35 x 0.8: A 1.27,0; C -1.27,0
SOD-123 = smd 1.4 x 1.4: A 1.85,0; C -1.85,0
DO220AAL = smd 2.667 x 2.54: P$1 -0.7,0 | smd 0.762 x 1.27: P$2 1.65,0
TRACE_ANTENNA_2.4GHZ_25.7MM_TUNED = smd 0.46 x 0.46: ANT 0,0.23 | smd 1 x 0.46: GND -1.18,0.23; GND2 -3.38,0.23
1X06 = drill 1.016 pad 1.88: 1 0,0; 2 2.54,0; 3 5.08,0; 4 7.62,0; 5 10.16,0; 6 12.7,0
2X02 = drill 1.016 octagon: 1 -1.27,-1.27; 2 -1.27,1.27; 3 1.27,-1.27; 4 1.27,1.27
1X06' = drill 1.016 long: 1 -6.35,0; 2 -3.81,0; 3 -1.27,0; 4 1.27,0; 5 3.81,0; 6 6.35,0
SRU5028 = smd 1.1 x 2: 1 2.4,0; 2 -2.4,0 | smd 2 x 1.1: P$1 0,2.4; P$2 0,-2.4
0603 = smd 1.1 x 1: 1 -0.85,0; 2 0.85,0
UG-9664HDDAG01_WRAPAROUND = smd 0.35 x 3: 1 -7.7,4.138; 2 -7,4.138; 3 -6.3,4.138; 4 -5.6,4.138; 5 -4.9,4.138; 6 -4.2,4.138; 7 -3.5,4.138; 8 -2.8,4.138; 9 -2.1,4.138; 10 -1.4,4.138; 11 -0.7,4.138; 12 0,4.138; 13 0.7,4.138; 14 1.4,4.138; 15 2.1,4.138; 16 2.8,4.138; 17 3.5,4.138; 18 4.2,4.138; 19 4.9,4.138; 20 5.6,4.138; 21 6.3,4.138; 22 7,4.138; 23 7.7,4.138 | hole 1: -8,0.688; 8,0.688
LED3535 = smd 1 x 0.85: 1 -1.75,0.875; 2 -1.75,-0.875; 3 1.75,-0.875; 4 1.75,0.875
RES-0603 = smd 1.1 x 1: 1 -0.85,0; 2 0.85,0
AYZ0202 = smd 1 x 1.15: 1 -2.5,2.825; 2 0,2.825; 3 2.5,2.825; 4 -2.5,-2.825; 5 0,-2.825; 6 2.5,-2.825 | hole 0.85: 1.5,0; -1.5,0
SOT23-5 = smd 0.55 x 1.2: 1 -0.95,-1.3; 2 0,-1.3; 3 0.95,-1.3; 4 0.95,1.3; 5 -0.95,1.3
QFN48-0.4MM = smd 0.8 x 0.23: 1 -2.95,2.2; 2 -2.95,1.8; 3 -2.95,1.4; 4 -2.95,1; 5 -2.95,0.6; 6 -2.95,0.2; 7 -2.95,-0.2; 8 -2.95,-0.6; 9 -2.95,-1; 10 -2.95,-1.4; 11 -2.95,-1.8; 12 -2.95,-2.2; 25 2.95,-2.2; 26 2.95,-1.8; 27 2.95,-1.4; 28 2.95,-1; 29 2.95,-0.6; 30 2.95,-0.2; 31 2.95,0.2; 32 2.95,0.6; 33 2.95,1; 34 2.95,1.4; 35 2.95,1.8; 36 2.95,2.2 | smd 0.23 x 0.8: 13 -2.2,-2.95; 14 -1.8,-2.95; 15 -1.4,-2.95; 16 -1,-2.95; 17 -0.6,-2.95; 18 -0.2,-2.95; 19 0.2,-2.95; 20 0.6,-2.95; 21 1,-2.95; 22 1.4,-2.95; 23 1.8,-2.95; 24 2.2,-2.95; 37 2.2,2.95; 38 1.8,2.95; 39 1.4,2.95; 40 1,2.95; 41 0.6,2.95; 42 0.2,2.95; 43 -0.2,2.95; 44 -0.6,2.95; 45 -1,2.95; 46 -1.4,2.95; 47 -1.8,2.95; 48 -2.2,2.95 | smd 4.3 x 4.3: EP 0,0
QFN-44-NOPAD_1:1-OUTFAKES = smd 0.8 x 0.3: 1 -3.337,2.465; 2 -3.337,1.972; 3 -3.337,1.479; 4 -3.337,0.986; 5 -3.337,0.493; 6 -3.337,0; 7 -3.337,-0.493; 8 -3.337,-0.986; 9 -3.337,-1.479; 10 -3.337,-1.972; 11 -3.337,-2.465; 23 3.337,-2.465; 24 3.337,-1.972; 25 3.337,-1.479; 26 3.337,-0.986; 27 3.337,-0.493; 28 3.337,0; 29 3.337,0.493; 30 3.337,0.986; 31 3.337,1.479; 32 3.337,1.972; 33 3.337,2.465 | smd 0.3 x 0.8: 12 -2.465,-3.337; 13 -1.972,-3.337; 14 -1.479,-3.337; 15 -0.986,-3.337; 16 -0.493,-3.337; 17 0,-3.337; 18 0.493,-3.337; 19 0.986,-3.337; 20 1.479,-3.337; 21 1.972,-3.337; 22 2.465,-3.337; 34 2.465,3.337; 35 1.972,3.337; 36 1.479,3.337; 37 0.986,3.337; 38 0.493,3.337; 39 0,3.337; 40 -0.493,3.337; 41 -0.986,3.337; 42 -1.479,3.337; 43 -1.972,3.337; 44 -2.465,3.337
SOIC-8 = smd 0.61 x 1.702: 1 -1.905,-3.251; 2 -0.635,-3.251; 3 0.635,-3.251; 4 1.905,-3.251; 5 1.905,3.251; 6 0.635,3.251; 7 -0.635,3.251; 8 -1.905,3.251
BUTTON = smd 1.65 x 1.1: 1 -4.325,2.25; 2 4.325,2.25; 3 -4.325,-2.25; 4 4.325,-2.25
AA = drill 1.17: + 26.16,-6.795; - 26.16,6.795
USB-MICRO-TH-SUPPORT = smd 0.4 x 1.35: 1 -1.3,2.7; 2 -0.65,2.7; 3 0,2.7; 4 0.65,2.7; 5 1.3,2.7 | smd 1.25 x 0.95: P$1 2.5,2.7; P$2 -2.5,2.7 | smd 1.5 x 1.5: P$3 -1,0; P$4 1,0 | smd 1.645 x 1.55: P$5 3.123,0; P$6 -3.123,0
SOT223 = smd 1.219 x 2.235: 1 -2.311,-3.099; 2 0,-3.099; 3 2.311,-3.099 | smd 3.6 x 2.2: 4 0,3.099
SOT-363 = smd 0.4 x 0.8: 1 -0.65,-0.8; 2 0,-0.8; 3 0.65,-0.8; 4 0.65,0.8; 5 0,0.8; 6 -0.65,0.8
8-VDFN = smd 0.6 x 0.3: 1 -1.4,0.95; 2 -1.4,0.35; 3 -1.4,-0.3; 4 -1.4,-0.95; 5 1.4,-0.95; 6 1.4,-0.3; 7 1.4,0.35; 8 1.4,0.95 | smd 1.65 x 2.4: 9 0,0
XTAL3215 = smd 1.1 x 1.9: P$1 1.2,0; P$2 -1.2,0
CRYSTAL-SMD-5X3.2-4PAD = smd 1.9 x 1.1: 1 -1.85,-1.15; 2 1.85,-1.15; 3 1.85,1.15; 4 -1.85,1.15
CRYSTAL-SMD-3.2X2.5 = smd 1.2 x 1.1: 1 -1.175,-0.875; 2 1.175,-0.875; 3 1.175,0.875; 4 -1.175,0.875

### Placement (x,y rotation side)
C1  52.2,48.31 90 top
C2  44.12,45.57 0 top
C3  44.12,37.64 0 top
C4  32.84,63.4 270 top
C5  56.16,42.47 270 top
C6  70.48,45.42 0 top
C7  80.24,44.04 180 top
C8  22.78,63.4 270 top
C9  80.24,45.57 180 top
C10  76.28,79.55 270 top
C11  120.78,67.97 180 top
C12  122.3,62.99 90 top
C13  121.54,55.58 180 top
C14  103.4,67.51 180 top
C15  103.4,68.88 0 top
C16  119.35,58.22 90 top
C17  109.65,67.97 90 top
C18  111.94,68.88 0 top
C19  119.86,62.99 90 top
C20  120.78,65.28 0 top
C21  120.01,66.65 0 top
C22  121.54,60.76 0 top
C23  115.6,67.97 90 top
C24  114.22,67.97 90 top
C25  118.49,55.58 0 top
C26  101.57,63.25 90 top
C27  94.41,58.52 0 top
C28  22.94,59.89 0 top
C29  32.69,59.89 180 top
C30  101.12,52.27 90 top
C31  91.97,34.29 90 top
C32  78.1,23.32 90 top
C33  58.75,18.75 90 top
C34  39.4,23.32 90 top
C35  25.53,34.29 90 top
C36  16.54,52.43 90 top
C37  16.84,72.24 90 top
C38  25.68,90.53 90 top
C39  39.85,101.5 90 top
C40  58.75,106.07 90 top
C41  77.65,101.5 90 top
C42  91.67,90.83 90 top
C43  100.66,72.24 90 top
C44  61.95,45.11 270 top
C45  65,45.11 90 top
C46  58.45,39.32 270 top
C47  49.91,36.58 0 top
D1  55.7,62.23 90 top
D2  62,56.69 0 top
D3  79.48,40.08 180 top
D5  27.81,56.69 180 top
E1  123.22,63.7 270 top
FTDI  55.65,48.46 0 top
JP1  21.62,102.44 180 bottom
JP2  102.29,102.44 180 bottom
JP4  [1X06']  62,24.23 0 top
L1  70.48,41.4 90 top
L2  120.78,69.34 0 top
LCD1  62,78.33 0 top
LED1  62,106.07 0 top
LED2  80.85,101.5 0 top
LED3  94.87,90.83 0 top
LED4  103.86,72.24 0 top
LED5  104.32,52.27 0 top
LED6  95.17,34.29 0 top
LED7  81.31,23.32 0 top
LED8  61.95,18.75 0 top
LED9  42.6,23.32 0 top
LED10  20.04,72.24 0 top
LED11  28.73,34.29 0 top
LED12  28.88,90.53 0 top
LED13  19.74,52.43 0 top
LED14  43.05,101.5 0 top
R1  68.3,62.23 90 top
R2  62.1,33.68 90 top
R3  44.12,47.09 180 top
R4  47.78,79.55 90 top
R5  62,101.8 0 top
R6  80.24,42.52 0 top
R7  77.8,44.04 270 top
R8  108.28,67.97 270 top
R9  121.08,62.99 90 top
R10  104.62,58.83 180 top
R11  63.63,33.68 90 top
R12  59.97,39.32 270 top
R13  65.15,33.68 270 top
R14  61.8,9.6 270 top
R15  64.54,9.6 270 top
S1  62,62.23 270 top
U1  75.36,44.04 0 top
U2  111.79,62.23 270 top
U4  50.98,41.86 270 top
U5  94.41,62.23 90 top
U$1  33.68,79.43 0 top
U$2  41.76,87.86 0 top
U$3  82.3,87.76 0 top
U$4  90.37,79.32 0 top
U$5  62,67.06 0 bottom
U$6  62,1.7 0 top
U$7  27.81,63.6 0 top
U$8  48.69,48.46 90 top
U$9  75.31,48.46 90 top
U$10  63.63,39.32 90 top
X2  106.15,66.29 270 top
Y1  44.12,41.61 270 top
Y2  121.54,58.17 270 top

### Tracks (layer width: path | path; a pad name or v marks a point on that pad's centre or on a via)
3V3
  Top 0.356: C29.2 30.73,59.89 U$7.3 31.62,62 C4.A 54.91,62 55.09,62.18 59.13,62.18 S1.5
3V3_IN_REG  (via drill 0.35)
  Top 0.356: C44.2 61.95,44.2 | v59.46,45.87 59.46,45.11 60.43,44.15 61.9,44.15 61.95,44.2 | U$10.8 61.95,41.45 61.95,44.2 | S1.4 54.44,64.73 53.87,64.16 v53.87,63.4 | v53.87,61.11 v53.87,57.91
  Bottom 0.305: 59.46,54.15 v59.46,45.87
  Bottom 0.356: v53.87,57.91 55.7,57.91 59.46,54.15 | v53.87,63.4 v53.87,61.11
3V3_OUT  (via drill 0.35)
  Top 0.152: C6.2 71.25,45.5
  Top 0.229: C22.1 120.64,60.71
  Top 0.254: 115.44,66.75 C23.1 | v117.02,62.08 116.67,62.43 U2.43 | U2.46 117.8,63.63 118.49,62.94 118.49,62.18 v118.8,61.87 118.8,61.42 119.51,60.71 120.64,60.71 | R10.1 v106.76,58.83 | C25.1 117.49,55.63 v115.9,55.63 | U2.3 113,65.18 U2.4 | R3.2 43.36,47.18 | 114.72,60.01 U2.37 | 114.72,60.01 114.68,59.98 | v115.9,55.63 115.14,56.39 115.14,57.45 114.99,57.61 114.99,59.74 114.72,60.01 | U2.19 106.76,62.03 106.3,61.57 103.25,61.57 v102.79,62.03 101.94,62.03 C26.1 | v115.9,55.63 115.9,55.02 116.51,54.41 v120.01,54.41 | U2.1 114.18,65.38 v114.99,65.38 | C47.1 49.01,36.63
  Top 0.305: C23.1 C24.1 | C24.1 114.14,67.21 113.46,67.21 113,66.75 113,65.18 | v113.16,67.82 113.85,67.12 C24.1 | 108.34,68.92 v107.09,68.92 | 119,66.34 C21.1 118.64,66.87 v118.64,67.97 | U4.44 53.54,44.32 53.26,44.04 53.26,40.08 | 53.26,40.08 53.26,39.93 53.8,39.39 U4.34 56.23,39.39 57.07,40.23 58.38,40.23 C46.1 | 51.74,40.08 v51.59,40.08 51.59,41.3 49.55,43.34 U4.14 | 51.74,40.08 53.26,40.08 | 51.74,40.08 51.28,39.62 49.45,39.62 49.01,39.18 U4.24 49.01,36.63
  Top 0.356: 71.4,45.41 C6.2 | 71.4,45.41 v73.08,45.41 74.19,45.41 U1.5 U1.4 79.13,48.31 87.2,56.39 v87.86,56.39 | U5.8 91.16,59.79 92.43,58.52 C27.1 93.56,57.54 v94.72,56.39 | 70.68,44 70.64,44.04 | LED5.2 101.45,51.4 C30.1 | 78.11,22.52 78.13,22.29 71.99,16.15 61.92,16.15 LED8.2 58.62,17.87 C33.1 45.09,17.89 40.67,22.32 LED9.2 39.42,22.44 C34.1 37.62,22.47 26.92,33.16 26.92,33.42 | 78.11,22.52 C32.1 | 26.92,33.42 LED11.2 | 26.92,33.42 26.65,33.44 C35.1 22.26,33.44 17.99,37.72 LED13.2 17.66,51.58 C36.1 15.1,51.58 14.55,52.12 14.55,70.32 15.62,71.39 C37.1 | 58.53,105.61 C40.1 58.78,105.19 | 26.95,89.83 LED12.2 27.1,89.68 C38.1 | 41.13,100.8 LED14.2 39.57,100.62 C39.1 39.7,100.8 39.09,100.8 | 39.09,100.8 30.01,100.8 24,94.79 24,90.53 24.85,89.68 C38.1 | 39.09,100.8 38.33,101.56 38.33,104.09 40.31,106.07 51.89,106.07 52.77,105.19 58.78,105.19 | U$9.5 72.31,48.46 v71.86,48.92 68.3,52.48 R1.1 | U$8.5 v45.8,48.46 44.27,48.46 43.36,47.55 43.36,47.18 | 56.01,82.47 LCD1.3 | 56.01,82.47 LCD1.4 | R5.1 60.23,102.72 60.23,104.94 | R5.1 56.01,96.66 56.01,82.47 | 71.4,45.41 71.4,44.72 70.68,44 | 70.68,44 L1.1 68.44,43.8 v67.13,45.11 | LED5.2 99.55,51.4 98.37,52.58 v98.37,53.49 | C46.1 R12.1 v59.97,42.98 | R8.1 108.34,68.92 | LED5.2 103.75,51.4 104.62,52.27 112.55,52.27 v115.9,55.63 | 93.65,33.41 LED6.2 92.3,33.41 C31.1 91.97,26.98 85.57,20.57 80.85,20.57 79.71,21.71 79.71,22.29 LED7.2 78.19,22.44 78.11,22.52 | 58.78,105.19 59.97,105.19 60.23,104.94 | C37.1 16.47,71.39 15.01,72.85 15.01,82.14 22.48,89.61 25.31,89.61 C38.1 | LED10.2 16.87,71.36 C37.1 | v107.09,68.92 105.9,70.1 103.37,70.1 LED4.2 100.69,71.36 C43.1 99.59,72.45 99.59,83.79 93.42,89.95 LED3.2 93.09,89.98 C42.1 91.52,90.13 90.38,90.13 v85.42,95.1 79.89,100.62 LED2.2 77.83,100.62 C41.1 76.67,100.65 73.53,103.78 61.66,103.78 61.15,103.27 R5.1
  Top 0.356: v115.29,70.41 v118.64,70.41 | LED1.2 60.23,105.17 60.23,104.94 | U$10.7 63.28,44.91 v63.47,45.11
  Bottom 0.254: v118.8,61.87 118.64,62.03 v118.64,67.97 | v117.02,62.08 117.22,61.87 v118.8,61.87 | v107.09,68.92 107.09,62.97 106.15,62.03 106.15,60.96 | v106.76,58.83 106.15,59.44 106.15,60.96 | v120.01,54.41 120.01,58.67 118.8,59.89 v118.8,61.87 | v102.79,62.03 102.95,62.03 103.71,61.27 105.84,61.27 106.15,60.96
  Bottom 0.305: v107.09,68.92 107.06,68.89 108.13,67.82 v113.16,67.82 114.99,65.99 v114.99,65.38 | v51.59,40.08 46.71,40.08 45.8,41 v45.8,48.46
  Bottom 0.356: v98.37,53.49 95.48,56.39 v94.72,56.39 v87.86,56.39 | v59.97,42.98 62.1,45.11 v63.47,45.11 v67.13,45.11 | v73.08,45.41 73.08,47.7 v71.86,48.92 | v113.16,67.82 113.16,68.43 v115.29,70.41 | v118.64,70.41 v118.64,67.97 | 85.42,95.25 v85.42,95.1 93.95,95.1 97.15,98.3 97.15,101.19 99.67,103.71 JP2.1
3V_IN_BATT  (via drill 0.35)
  Top 0.356: v66.83,43.59 66.15,44.26 C45.1 63.93,43.19 U$10.6 | v70.18,49.23 66.83,52.58 v66.83,58.98 | v68.2,64.77 68.16,64.73 S1.1
  Bottom 0.356: v66.83,43.59 68.81,43.59 70.18,44.96 v70.18,49.23 | v66.83,58.98 68.2,60.35 v68.2,64.77
5V  (via drill 0.35)
  Top 0.254: v50.06,46.63 50.83,47.4 v50.83,48.62
  Top 0.305: U4.2 52.96,45.19 52.96,44.65 52.65,44.35 52.65,43.74 52.04,43.13 v51.59,43.13 50.98,43.13 50.48,43.62 U4.7
  Top 0.356: 25.5,60.05 U$7.1 | 25.5,60.05 25.5,59.92 27.2,58.22 28.12,58.22 29.64,56.69 D5.C v50.83,56.69 D2.C | C8.A 23.79,61 C28.2 23.94,60.05 25.5,60.05
  Bottom 0.254: v51.59,43.13 50.67,44.04 50.67,46.02 v50.06,46.63 | v50.83,48.62 v50.83,56.69
12V  (via drill 0.35)
  Top 0.356: D3.P$1 81.09,41.45 R6.2 C7.1 C9.1 81.09,46.85 v81,46.94 | v81,56.24 81,70.71 v72.62,79.1 | v72.62,84.58 71.7,85.5 70.18,85.5 69,84.32 LCD1.22
  Bottom 0.356: v81,46.94 v81,56.24 | v72.62,79.1 v72.62,84.58
ATMEGA_RX  (via drill 0.35)
  Top 0.254: U4.20 48.39,40.39 48.84,40.84 v48.84,41.45 | 49.53,47.85 U$8.1 48.69,47.01 v48.69,46.63
  Bottom 0.254: 48.84,46.48 v48.69,46.63 50.06,45.26 50.06,42.06 49.76,41.76 49.15,41.76 v48.84,41.45
ATMEGA_TX  (via drill 0.35)
  Top 0.254: U4.21 49.11,39.89 49.27,40.06 49.28,40.06 v50.22,41 | v77.34,47.85 77.3,47.81 U$9.1
  Bottom 0.254: v50.22,41 52.65,41 53.42,40.23 53.42,38.56 54.79,37.19 66.67,37.19 v77.34,47.85
CS  (via drill 0.35)
  Top 0.229: U2.21 107.33,61.23 106.76,60.66 100.96,60.66 100.2,61.42 100.2,65.68 97,68.89 v96.55,68.89 | LCD1.8 59.2,79.41 v63.32,75.29
  Bottom 0.229: v63.32,75.29 64.39,74.22 91.21,74.22 v96.55,68.89
D+  (via drill 0.35)
  Top 0.254: U4.4 51.96,46.3 v51.99,46.33 | v55.24,38.41 v55.24,35.2 | R15.1 64.54,10.97 v63.78,11.73
  Bottom 0.254: v51.99,46.33 55.24,43.08 v55.24,38.41 | v55.24,35.2 55.24,26.98 54.61,26.34 54.61,23.04 63.78,13.87 v63.78,11.73
D-  (via drill 0.35)
  Top 0.254: v53.72,28.04 53.72,32.61 56.92,35.81 v56.92,38.41 | v57.99,41.91 57.99,44.35 55.85,46.48 53.11,46.48 52.46,45.83 U4.3 | R14.1 61.8,11.73 v61.65,11.89
  Bottom 0.254: v61.65,11.89 53.72,19.81 v53.72,28.04 | v57.99,41.91 57.99,39.47 v56.92,38.41
DC  (via drill 0.35)
  Top 0.229: LCD1.10 60.58,82.45 60.58,80.62 65,76.2 v67.74,76.2 | U2.16 104.42,63.23 104.17,63.48 103.17,63.48 102.95,63.7 102.95,65.53 102.34,66.14 v102.34,66.45
  Bottom 0.229: v67.74,76.2 99.29,76.2 102.34,73.15 v102.34,66.45
ESP_RX  (via drill 0.35)
  Top 0.229: U2.40 115.56,61.23 116.36,60.43 116.36,59.28 v117.58,58.06 | v115.44,49.07 108.13,49.07 v107.98,49.23 | U$9.4 74.51,52.64 77.34,55.47 v82.98,55.47
  Top 0.305: D1.A 60.17,63.5 61.19,62.48 62.86,62.48 63.63,63.25 68.13,63.25 R1.2 68.82,63.08 70.48,61.42 70.48,52.43 73.8,49.11 U$9.4
  Bottom 0.229: v117.58,58.06 118.19,57.45 118.19,51.82 v115.44,49.07 | v82.98,55.47 89.23,49.23 v107.98,49.23
ESP_TX  (via drill 0.35)
  Top 0.229: U2.41 115.7,61.63 116.97,60.36 116.97,59.89 v117.73,59.13 | v115.75,47.09 v107.37,47.09 | v43.81,49.38 47.63,49.38 U$8.4 | v82.37,40.54 89.08,40.54 v95.63,47.09
  Bottom 0.229: v117.73,59.13 118.8,58.06 118.8,50.14 v115.75,47.09 | v107.37,47.09 v95.63,47.09 | v43.81,49.38 43.81,40.23 47.93,36.12 77.95,36.12 v82.37,40.54
FLASH_SCK  (via drill 0.35)
  Top 0.229: U2.31 111.99,56.74 111.48,56.24 100.81,56.24 v98.83,58.22 | v93.19,62.79 93.12,62.87 U5.6
  Bottom 0.229: v98.83,58.22 93.95,62.79 v93.19,62.79
FLASH_SCS
  Top 0.229: U2.30 111.59,57.1 111.18,56.69 101.6,56.69 97.97,60.33 U5.1
FLASH_SDI
  Top 0.229: U5.5 91.03,64.01 90.3,64.01 89.84,63.55 89.84,58.52 93.04,55.32 112.24,55.32 112.79,55.86 U2.33
FLASH_SDO
  Top 0.229: U5.2 96.57,61.59 96.09,61.11 96.09,59.89 100.2,55.78 111.79,55.78 112.39,56.38 U2.32
FLASH_SHD  (via drill 0.35)
  Top 0.229: U5.7 91.19,61.57 92.58,61.57 v93.19,60.96 | U2.28 110.79,57.83 110.57,57.61 102.95,57.61 v102.64,57.91
  Bottom 0.229: v102.64,57.91 102.18,57.45 96.7,57.45 v93.19,60.96
FLASH_SWP  (via drill 0.35)
  Top 0.229: U2.29 111.19,57.46 110.87,57.15 102.34,57.15 v101.12,58.37 | v95.94,62.79 96.01,62.87 U5.3
  Bottom 0.229: v95.94,62.79 96.39,62.79 100.81,58.37 v101.12,58.37
FTDI_RX
  Top 0.305: FTDI.2 56.21,50.44 50.82,50.44 U$8.3
FTDI_TX  (via drill 0.35)
  Top 0.305: U$9.3 77.84,49.11 v77.95,49.23 | D1.C 58.14,58.52 61.19,58.52 61.95,57.76 61.95,49.68 FTDI.3
  Bottom 0.305: FTDI.3 60.73,49.23 62.1,50.6 76.43,50.6 77.95,49.07 v77.95,49.23
GND  (via drill 0.35)
  Top 0.254: C20.2 122,65.44 v122,66.6 | v122.76,68.58 123.45,67.89 E1.GND2 E1.GND
  other vias: 111.79,62.18 122.3,58.19 51.59,44.2 101.37,65.23 94.41,64.01 122.76,69.8 122.76,71.17 122.76,72.54 122.76,73.91 122.76,75.44 122.76,54.25 122.76,53.04 122.76,51.82 122.76,50.6 122.76,49.23 121.23,54.25 121.23,53.04 121.23,51.82 121.23,50.6 121.23,49.23 119.86,53.04 119.86,51.82 119.86,50.6 119.86,49.23 121.39,75.44 121.39,73.91 121.39,72.54 121.39,71.17 119.71,75.44 119.71,73.91 119.71,72.54 119.71,71.17 24.77,70.71 29.79,70.71 34.98,70.71 40.01,70.71 44.12,70.71 49,70.71 53.26,70.71 57.99,70.71 109.35,73.76 109.35,72.09 109.35,70.41 112.7,73.76 115.75,73.76 112.7,72.09 115.6,72.09 112.7,70.41 115.29,53.19 116.97,53.19 115.29,51.21 113.31,51.21 111.48,51.21 62.87,70.71 68.2,70.71 74.14,70.71 78.87,70.71 82.98,70.71 87.4,70.71 18.52,60.66 23.09,42.98 34.52,28.8 51.59,20.12 72.62,19.96 89.53,28.8 100.66,42.21 100.81,82.45 88.93,96.62 52.65,104.24 35.13,96.62 23.39,82.91 90.3,114.3 34.82,114.76 9.98,90.83 2.82,64.01 8.31,37.19 24.61,16.31 47.62,4.88 77.19,5.03 102.64,19.51 116.51,39.32 112.24,93.88 32.39,52.58 40.16,52.73 47.62,52.73 55.55,52.73 72.77,52.73 78.56,52.73 92.58,52.73 34.67,43.13 41.07,36.73 50.52,31.24 59.36,29.41 71.09,30.48 85.42,39.17 90.45,44.5 41.53,45.57 47.32,45.87 48.84,42.52 56.01,40.39 63.63,39.32
  pour Top (rank 6): -15.32,133.2 145.77,133.2 145.77,3.51 145.77,-7.77 25.22,-7.77 -19.13,-7.77 -19.13,133.2
  pour Bottom (rank 6): -20.5,135.03 148.51,135.03 148.51,-9.6 -21.26,-9.6 -21.26,135.03
GPIO0
  Top 0.229: U2.23 107.9,60.43 107.21,59.74 104.32,59.74 103.86,59.28 103.86,58.89 R10.2 102.86,59.74 100.51,59.74 99.29,60.96 99.29,64.31 97.76,65.84 97.76,66.75 96.55,67.97 95.63,67.97 91.52,72.08 84.2,72.08 77.97,78.31 U$3.3
  Top 0.254: U$3.4 U$3.3
GPIO2  (via drill 0.35)
  Top 0.229: U2.22 107.54,60.83 106.91,60.2 100.81,60.2 99.75,61.27 99.75,65.08 v99.29,65.53 | v98.68,75.44 97.04,77.07 U$4.4
  Top 0.254: U$4.4 U$4.3
  Bottom 0.229: v99.29,65.53 99.29,74.83 v98.68,75.44
GPIO4  (via drill 0.35)
  Top 0.229: U2.24 108.42,60.03 107.98,59.59 v107.98,58.83 | v61.04,76.05 47.93,76.05 45.95,78.03 45.95,85.46 45.8,85.61
  Top 0.254: U$2.3 45.8,85.61 U$2.4
  Bottom 0.229: v107.98,58.83 107.98,58.37 107.67,58.06 106.15,58.06 102.95,61.27 100.96,61.27 88.93,73.3 63.78,73.3 v61.04,76.05
GPIO5  (via drill 0.35)
  Top 0.229: U2.34 113.19,57.88 v113.46,57.61 | v96.85,50.6 96.85,46.94 86.94,37.03 84.05,37.03 74.9,27.89 66.93,27.89 JP4.4
  Bottom 0.229: v113.46,57.61 107.82,51.97 97.61,51.97 96.85,51.21 v96.85,50.6
GPIO12  (via drill 0.35)
  Top 0.229: v103.86,62.28 104.01,62.43 U2.18 | v97,66.29 90.91,66.29 89.38,64.77 89.38,58.22 | v83.13,41.6 83.13,42.37 83.9,43.13 86.33,43.13 89.38,46.18 89.38,58.22 | 89.38,58.06 89.38,58.22
  Bottom 0.229: v103.86,62.28 103.2,62.94 100.05,62.94 97,65.99 v97,66.29 | v83.13,41.6 83.13,40.84 83.17,40.81 83.17,39.51 78.56,34.9 66.32,34.9 JP4.1
GPIO16  (via drill 0.35)
  Top 0.229: v58.14,77.11 v50.22,77.11 | v43.97,77.11 38.07,77.11 U$1.4 | U2.25 108.84,58.53 v108.84,58.32
  Top 0.254: U$1.4 U$1.3
  Bottom 0.229: v50.22,77.11 v43.97,77.11 | v58.14,77.11 63.02,72.24 88.47,72.24 100.05,60.66 102.49,60.66 105.69,57.45 107.98,57.45 v108.84,58.32
GPIO17  (via drill 0.35)
  Top 0.229: U2.27 110.39,58.75 v109.96,58.32 | v97.15,52.73 96.85,52.73 86.49,42.37 v84.2,42.37
  Bottom 0.229: v109.96,58.32 104.37,52.73 v97.15,52.73 | v84.2,42.37 84.2,38.41 74.9,29.11 65.61,29.11 JP4.3
GPIO18  (via drill 0.35)
  Top 0.229: v113.92,56.69 114.15,56.92 114.15,58.06 113.61,58.6 113.61,58.61 113.59,58.64 U2.35 | JP4.5 68.4,26.82 68.96,26.82 | 97.76,50.14 v98.07,50.44 97.46,49.84 97.46,46.48 87.1,36.12 86.18,36.12
  Top 0.254: 68.96,26.82 74.9,26.82 84.2,36.12 86.18,36.12 86.33,36.12
  Bottom 0.254: v113.92,56.69 108.43,51.21 98.83,51.21 v98.07,50.44
GPIO19  (via drill 0.35)
  Top 0.229: U2.38 115.23,60.42 115.44,60.22 115.44,58.37 115.9,57.91 v115.9,57 | v99.75,50.14 98.22,48.62 98.22,46.33 86.79,34.9 84.81,34.9 74.14,24.23 JP4.6
  Bottom 0.229: v115.9,57 109.04,50.14 v99.75,50.14
GPIO25  (via drill 0.35)
  Top 0.229: U2.14 105.21,64.03 v104.17,65.08 | v83.29,43.74 85.88,43.74 88.93,46.79 88.93,55.63 88.93,55.78 88.93,65.23 90.91,67.21 v96.24,67.21 | v73.69,37.34 72.62,37.34 v69.27,33.98
  Bottom 0.229: v104.17,65.08 103.1,65.08 101.42,63.4 100.36,63.4 98.07,65.68 98.07,66.6 97.46,67.21 v96.24,67.21 | v83.29,43.74 76.89,37.34 v73.69,37.34 | JP4.2 67.94,33.98 v69.27,33.98
LEDS
  Top 0.229: LED5.1 103.1,53.22 103.1,54.1 103.71,54.71 113.16,54.71 114.68,56.24 114.68,57.3 114.53,57.45 114.53,58.74 U2.36
MOSI  (via drill 0.35)
  Top 0.229: U2.20 106.97,61.63 106.45,61.11 101.12,61.11 100.66,61.57 100.66,65.99 93.65,73 85.27,73 80.24,78.03 v80.09,78.03 | LCD1.14 63.4,80.24 65.3,78.33 v67.74,78.33
  Bottom 0.229: v67.74,78.33 68.05,78.03 v80.09,78.03
N$1
  Top 0.254: U4.17 46.81,41.86 45.27,40.32 Y1.3 45.27,37.94 C3.2
N$2
  Top 0.254: U4.13 46.77,43.83 46.25,44.35 46.25,46.33 45.49,47.09 R3.1
N$3
  Top 0.254: U4.6 50.98,46.48 51.96,47.46 C1.1
N$4
  Top 0.254: U4.42 56.14,43.34 C5.1
N$5
  Top 0.254: U$6.2 61.35,8.3 R14.2
N$6
  Top 0.305: LCD1.21 68.35,80.77 68.81,80.31 76.19,80.31 C10.1
N$7
  Top 0.356: U1.1 74.41,41.79 76.12,40.08 D3.P$2 76.29,39 L1.2
N$8
  Top 0.254: C2.1 42.97,45.27 Y1.1 44.36,42.06 45.95,42.06 46.24,42.35 U4.16
N$10  (via drill 0.35)
  Top 0.229: v57.99,102.26 56.35,100.62 LED14.3 | v62.86,110.34 60.25,107.72 LED1.1
  Bottom 0.229: v57.99,102.26 59.51,102.26 62.86,105.61 v62.86,110.34
N$11
  Top 0.356: R6.1 C7.2 78.65,44.04 R7.2 77.35,42.74 U1.3
N$12
  cutout Top: 123.22,76.2 123.06,74.07 123.06,47.55 140.44,47.55 140.44,77.11 123.22,77.11
N$13
  Top 0.254: LCD1.7 58.55,80.57 58.14,80.16 48.17,80.16
  Top 0.305: 48.17,80.16 R4.2
N$14  (via drill 0.35)
  Top 0.356: S1.2 64.88,62.18 v66.52,62.18
  Bottom 0.356: v66.52,62.18 61.34,62.18 58.75,59.59 36.51,59.59 U$5.+
N$15
  Top 0.229: U2.9 110.78,65.7 110.49,65.99 109.04,65.99 108.43,66.6
  Top 0.254: R8.2 108.43,66.6
N$16
  Top 0.229: C16.2 119.35,60.3 118.1,61.56 118.1,62.73 117.59,63.23 U2.45 | C16.2 119.73,59.39 | C16.2 119.63,59.34 Y2.1
N$17
  Top 0.254: 122.37,63.7 C12.2 arc90 122.39,63.73
  Top 0.406: 122.37,63.7 122.76,64.1 122.76,67.21 122.45,67.51 C11.1
  Top 0.762: E1.ANT 122.37,63.7
N$18
  cutout Bottom: 123.06,77.11 123.06,47.55 140.44,47.55 140.44,77.11
N$19
  Top 0.229: LED1.3 77.61,105.19 79.17,103.63 79.17,102.45 LED2.1
N$20
  Top 0.254: FTDI.4 63.85,49.04
  Top 0.356: 63.85,49.04 D2.A
N$21  (via drill 0.35)
  Top 0.229: v97.92,43.89 97.15,43.89 93.88,40.62 | v105.38,43.89 106.07,44.57 LED5.3
  Top 0.254: 93.88,40.62 93.42,40.16 LED6.1
  Bottom 0.229: v105.38,43.89 v97.92,43.89
N$22
  Top 0.229: R9.2 C19.2 119.86,64.92 119.71,65.08 | U2.48 118.3,64.43 118.95,65.08 119.71,65.08 | 119.71,65.08 C20.1
N$23
  Top 0.229: U2.2 113.59,65.81 113.92,66.14 116.81,66.14
  Top 0.762: 116.51,66.14 116.81,66.14 117.12,66.45 117.12,67.97 118.34,69.34 L2.1 C11.2
N$24
  Top 0.229: 122.41,57.49 Y2.3 | C13.1 122.39,57.02 Y2.3 | U2.44 117.38,62.83 117.72,62.5 117.72,61.4 118.54,60.48 118.54,58.46 118.78,58.22 121.24,58.22 Y2.3
N$25
  Top 0.229: 119.8,61.94 118.95,62.79 118.95,63.25 118.16,64.03 U2.47 | C19.1 R9.1
  Top 0.254: 119.8,61.94 C19.1
N$26
  Top 0.229: 106.25,67.28 X2.P$2 | 105.78,67.56 X2.P$2 | U2.12 108.63,65.18 106.32,67.49 X2.P$2 | C15.2 105.38,68.89 106.15,68.12 X2.P$2
N$27
  Top 0.229: U2.13 106.81,64.43 X2.P$1 | 105.8,65.44 X2.P$1 | X2.P$1 105.52,65.09 104.17,66.45 104.17,67.42 C14.1
N$28
  Top 0.229: U2.5 112.39,68.33 C18.2
N$29
  Top 0.229: U2.6 111.99,67.99 C18.1
N$30
  Top 0.229: U2.7 111.59,66.34 110.57,67.36 110.57,67.97 109.72,68.82
  Top 0.254: C17.2 109.72,68.82
N$31
  Top 0.229: U2.8 111.19,65.98 110.04,67.12
  Top 0.254: 110.04,67.12 C17.1
N$32  (via drill 0.35)
  Top 0.356: D5.A 25.96,54.88 36.04,44.81 v36.04,27.58 | v58.75,11.12 60.7,9.17 U$6.1
  Bottom 0.356: v36.04,27.58 52.5,11.12 v58.75,11.12
N$33  (via drill 0.35)
  Top 0.229: LED6.3 97.57,33.22 v99.14,33.22 | v89.84,33.22 86.18,33.22 79.71,26.75 LED7.1
  Bottom 0.229: v99.14,33.22 v89.84,33.22
N$34  (via drill 0.35)
  Top 0.229: LED7.3 84.16,21.34 v85.12,21.34 | v60.27,21.95 60.27,19.69 LED8.1
  Bottom 0.229: v85.12,21.34 60.88,21.34 v60.27,21.95
N$35
  Top 0.229: LED8.3 62.67,17.87 61.95,18.59 61.95,25.6 61.19,26.36 42.29,26.36 40.69,24.77 LED9.1
N$36  (via drill 0.35)
  Top 0.229: LED9.3 46.71,24.81 v46.71,24.84 | v30.4,37.8 27.97,37.8 26.98,36.81 LED11.1
  Bottom 0.229: v46.71,24.84 33.76,37.8 v30.4,37.8
N$37
  Top 0.229: LED13.1 17.75,53.37 17.75,54.1 18.52,54.86 22.02,54.86 31.01,45.87 31.32,45.57 31.93,44.96 31.93,34.87 LED11.3
N$38  (via drill 0.35)
  Top 0.229: LED13.3 22.74,51.55 v22.78,51.51 | v24,54.25 v24,56.39 | LED10.1 18.29,75.05 v16.99,76.35
  Bottom 0.229: v22.78,51.51 23.24,51.51 24,52.27 v24,54.25 | v24,56.39 24,58.83 26.59,61.42 26.59,66.75 v16.99,76.35
N$39
  Top 0.229: LED12.1 27.02,91.59 27.81,91.59 28.73,90.68 28.73,86.41 23.09,80.77 23.09,72.39 22.06,71.36 LED10.3
N$40  (via drill 0.35)
  Top 0.229: v32.84,99.52 32.84,90.83 31.81,89.8 30.78,89.8 LED12.3 | 41.15,104.17 v40.46,104.85 | 41.15,104.17 41.15,104.16 | LED14.1 41.3,104.01 41.15,104.17
  Bottom 0.229: v32.84,99.52 38.18,104.85 v40.46,104.85
N$41
  Top 0.229: LED2.3 87.67,100.62 93.12,95.17 LED3.1
N$42
  Top 0.229: LED3.3 102.11,84.46 LED4.1
N$45
  Top 0.254: U$6.3 62,6.21 R15.2
N$53
  Top 0.356: 62.21,34.64 | 62.21,34.64 R2.2 | U$10.2 63.28,37.29 62.21,36.23 62.21,34.64
N$54
  Top 0.356: U$10.3 63.93,36.11 63.63,35.81 R11.2
N$58
  Top 0.356: U$10.1 60.52,37.92 R12.2
N$60
  Top 0.356: U$10.4 65.15,37.34 R13.1
RESET  (via drill 0.35)
  Top 0.229: LCD1.9 59.9,80.08 64.85,75.13 v67.74,75.13 | v90.14,75.13 93.04,75.13 100.05,68.12 v100.81,68.12 | U2.15 104.85,63.63 104.47,64.01 104.01,64.01 103.4,64.62 v103.4,66.45
  Top 0.254: R5.2 62.85,99.96 59.9,97.01 LCD1.9
  Bottom 0.229: v67.74,75.13 v90.14,75.13 | v103.4,66.45 102.64,65.68 102.03,65.68 100.81,66.9 v100.81,68.12
SCK  (via drill 0.35)
  Top 0.229: LCD1.13 62.71,82.46 62.71,79.7 65.15,77.27 v67.74,77.27 | v82.22,77.27 85.72,73.76 93.65,73.76 101.42,65.99 101.73,65.99 102.49,65.23 102.49,63.55 102.95,63.09 104.01,63.09 104.28,62.83 U2.17
  Bottom 0.229: v67.74,77.27 v82.22,77.27
SCL  (via drill 0.35)
  Top 0.229: U2.39 115.42,60.83 115.9,60.35 115.9,58.53 v117.42,57 | JP2.4 110.57,94.16 v110.57,89.61
  Bottom 0.229: v117.42,57 115.6,58.83 115.6,64.47 116.97,65.84 116.97,85.5 112.85,89.61 v110.57,89.61
SDA  (via drill 0.35)
  Top 0.229: U2.42 116.05,62.03 v117.88,60.2
  Bottom 0.229: v117.88,60.2 116.2,61.87 116.2,62.33 117.88,64.01 117.88,86.11 113,90.98 109.35,90.98 106.3,94.03 106.3,101.96 104.55,103.71 JP2.3
SWITCH  (via drill 0.35)
  Top 0.254: U4.1 55.33,45.2 v55.4,45.26 | v46.71,47.55 46.71,47.81 U$8.6
  Top 0.305: v67.89,46.33 68.5,46.94 71.55,46.94 72.43,47.81 U$9.6
  Bottom 0.254: v46.71,47.55 54.33,47.55 55.4,46.48 v55.4,45.26
  Bottom 0.305: v55.4,45.26 55.85,44.81 59.97,44.81 61.49,46.33 v67.89,46.33

### Text on the board
bPlace: VCC | SDA | GND | SCL | RX | TX | VCC | GND | GPIO12 | GPIO25 | GPIO17 | GPIO5 | GPIO18 | GPIO19
Reference: Changes in v1.1: / -Corrected LED wiring / -Corrected Power Mux Footprint / -Changed Shitty Addons Orientation / -Changed USB Resistors to 22 / -Modified Swtich to Control Both Input Voltages